# Altium project WroSat_RAD_SiPMT_detector_platform.PrjPCB (part 2 of 2)

## Sheet CAN_transceiver.SchDoc
size A4; Organization: Altium Limited; Address1: L3, 12a Rodborough Rd; Address2: Frenchs Forest; Address3: NSW; Address4: Australia 2086; DocumentNumber: 13; SheetNumber: 13; SheetTotal: 19
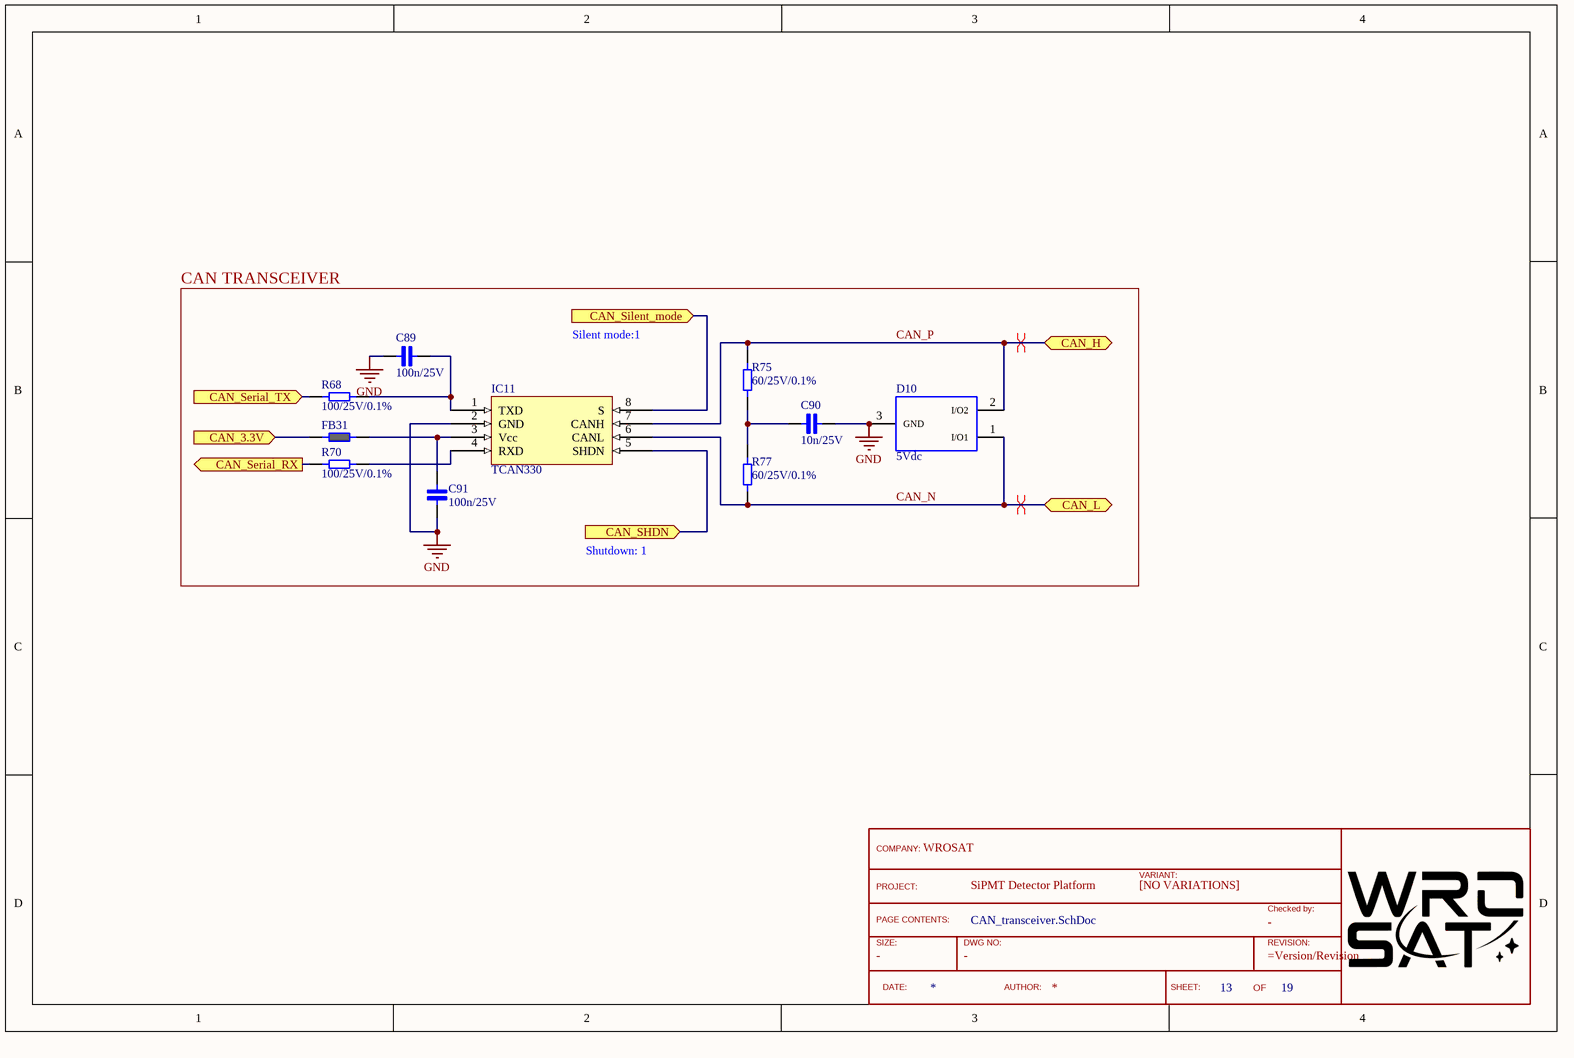
[diagram p8: CAN_transceiver.SchDoc]

### Parts
(Parts that share a designator on the sheet are numbered #1, #2 ... from top to bottom, then left to right.)
?#7  TitleBlock  (value not drawn)  (graphical)
C89  100n/25V  [Cap_0402]
C90  10n/25V  [Cap_0402]
C91  100n/25V  [Cap_0402]
D10  5Vdc  [WE-TVS_SOT23-3L]
FB31  Ferrite_bead_0402  [FERRITE_0402]  (value not drawn)
IC11  TCAN330  [SOIC8]
R68  100/25V/0.1%  [RES_0402]
R70  100/25V/0.1%  [RES_0402]
R75  60/25V/0.1%  [RES_1206]
R77  60/25V/0.1%  [RES_1206]

### Blocks framed on the sheet
CAN TRANSCEIVER: C89-C91 D10 FB31 IC11 R68 R70 R75 R77

### Ports
CAN_3.3V (in), CAN_H (bidir), CAN_L (bidir), CAN_Serial_RX (out), CAN_Serial_TX (in), CAN_SHDN (in), CAN_Silent_mode (in)

### Nets
GND: C89.1 C90.2 C91.1 D10.3(GND) IC11.2(GND)
CAN_3.3V: FB31.1 ; port CAN_3.3V
CAN_N: D10.1(I/O1) IC11.6(CANL) R77.1 ; port CAN_L
CAN_P: D10.2(I/O2) IC11.7(CANH) R75.2 ; port CAN_H
CAN_Serial_RX: R70.1 ; port CAN_Serial_RX
CAN_Serial_TX: R68.1 ; port CAN_Serial_TX
CAN_SHDN: IC11.5(SHDN) ; port CAN_SHDN
CAN_Silent_mode: IC11.8(S) ; port CAN_Silent_mode
NetC89_2: C89.2 IC11.1(TXD) R68.2
NetC90_1: C90.1 R75.1 R77.2
NetC91_2: C91.2 FB31.2 IC11.3(Vcc)
NetIC11_4: IC11.4(RXD) R70.2

### Layout directives
differential pair: CAN_N, CAN_P

### Notes on the sheet
- Silent mode:1
- Shutdown: 1
- Title
- Size:
- Date:
- A3
- Number:
- Time:
- Revision:
- Sheet
- of
- File:
- (in symbol TitleBlock) COMPANY:; VARIANT:; PROJECT:; [NO VARIATIONS]; Checked by:; PAGE CONTENTS:; SIZE:; DWG NO:; REVISION:; DATE:; AUTHOR:; SHEET:; OF

### Library data of the parts
?#7 = TitleBlock: Standard TitleBlock; DrawingNo: -; Size: -; Checked: -
C89 C91 = Cap_0402_100n: as C3 on sheet Preamplifier; ComponentLink1Description: New link; ComponentLink1URL: https://www.we-online.com/catalog/en/WCAP-CSGP-25VDC
C90 = Cap_0402_10n: as C32 on sheet General_design; ComponentLink1Description: New link; ComponentLink1URL: https://www.we-online.com/catalog/en/WCAP-CSGP-25VDC
D10 = 824022: WE-TVS TVS Diode - Standard Series, SOT23-3L, 2Channel, 5Vdc; Manufacturer: Wurth Elektronik; Reverse Breakdown Voltage min.: 6.1V; Channel: 2; Channel Input Capacitance: 12pF; Reverse Peak Pulse Current: 8A; Reverse Channel Leakage Current: 2.5uA; DC Operating Voltage: 5V; ComponentLink1Description: Manufacturer; ComponentLink1URL: http://www.we-online.de; ComponentLink2Description: Datasheet; ComponentLink2URL: https://www.we-online.com/catalog/datasheet/824022.pdf; Manufacturer Part Number: 824022; Published Date: April 2020; Size: SOT23-3L; Operating Temperature: -55 to +125degC; Mounting Technology: SMT; Packaging: Tape and Reel
FB31 = Ferrite_bead_0402: Ferrite bead, wurth 74269241102
IC11 = TCAN330: CAN transceiver, 3,3V
R68 R70 = Res_0402_100: Vishay, thin film resistor 100/25V/0.1%
R75 R77 = Res_1206_60: Vishay, thin film resistor 60/25V/0.1%

## Sheet MRAM.SchDoc
size A4; Organization: Altium Limited; Address1: L3, 12a Rodborough Rd; Address2: Frenchs Forest; Address3: NSW; Address4: Australia 2086; DocumentNumber: 15; SheetNumber: 15; SheetTotal: 19
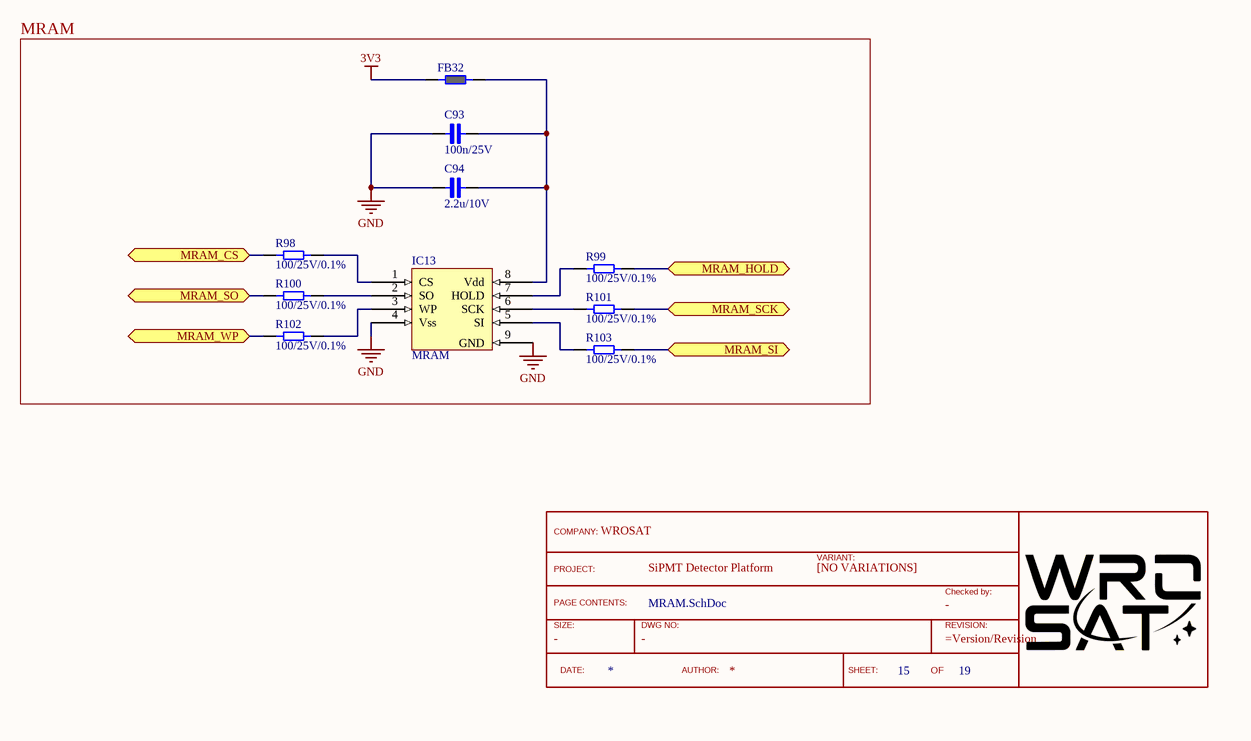
[diagram p9: MRAM.SchDoc]

### Parts
(Parts that share a designator on the sheet are numbered #1, #2 ... from top to bottom, then left to right.)
?#8  TitleBlock  (value not drawn)  (graphical)
C93  100n/25V  [Cap_0402]
C94  2.2u/10V  [CAP_0603]
FB32  Ferrite_bead_0402  [FERRITE_0402]  (value not drawn)
IC13  MRAM  [DFN8]
R98  100/25V/0.1%  [RES_0402]
R99  100/25V/0.1%  [RES_0402]
R100  100/25V/0.1%  [RES_0402]
R101  100/25V/0.1%  [RES_0402]
R102  100/25V/0.1%  [RES_0402]
R103  100/25V/0.1%  [RES_0402]

### Blocks framed on the sheet
MRAM: C93 C94 FB32 IC13 R98-R103

### Ports
MRAM_CS (bidir), MRAM_HOLD (bidir), MRAM_SCK (bidir), MRAM_SI (bidir), MRAM_SO (bidir), MRAM_WP (bidir)

### Nets
3V3: FB32.1
GND: C93.1 C94.1 IC13.4(Vss) IC13.9(GND)
MRAM_CS: R98.1 ; port MRAM_CS
MRAM_HOLD: R99.2 ; port MRAM_HOLD
MRAM_SCK: R101.2 ; port MRAM_SCK
MRAM_SI: R103.2 ; port MRAM_SI
MRAM_SO: R100.1 ; port MRAM_SO
MRAM_WP: R102.1 ; port MRAM_WP
NetC93_2: C93.2 C94.2 FB32.2 IC13.8(Vdd)
NetIC13_1: IC13.1(CS) R98.2
NetIC13_2: IC13.2(SO) R100.2
NetIC13_3: IC13.3(WP) R102.2
NetIC13_5: IC13.5(SI) R103.1
NetIC13_6: IC13.6(SCK) R101.1
NetIC13_7: IC13.7(HOLD) R99.1

### Notes on the sheet
- Title
- Size:
- Date:
- A3
- Number:
- Time:
- Revision:
- Sheet
- of
- File:
- (in symbol TitleBlock) COMPANY:; VARIANT:; PROJECT:; [NO VARIATIONS]; Checked by:; PAGE CONTENTS:; SIZE:; DWG NO:; REVISION:; DATE:; AUTHOR:; SHEET:; OF

### Library data of the parts
?#8 = TitleBlock: Standard TitleBlock; DrawingNo: -; Size: -; Checked: -
C93 = Cap_0402_100n: as C3 on sheet Preamplifier; ComponentLink1Description: New link; ComponentLink1URL: https://www.we-online.com/catalog/en/WCAP-CSGP-25VDC
C94 = Cap_0603_2.2u: Ceramic Capacitor 2.2uF / 0603 / 10V / ±5%, Wurth Elektronik MLCC
FB32 = Ferrite_bead_0402: Ferrite bead, wurth 74269241102
IC13 = MR25H128A: MRAM, 128Kb Serial SPI MRAM, EVERPIN technologies; ComponentLink1Description: New link; ComponentLink1URL: https://pl.mouser.com/datasheet/2/144/MR25H128A_Datasheet-1219034.pdf
R98-R103 = Res_0402_100: Vishay, thin film resistor 100/25V/0.1%

## Sheet LCL_pin_bias.SchDoc
size A4; Organization: Altium Limited; Address1: L3, 12a Rodborough Rd; Address2: Frenchs Forest; Address3: NSW; Address4: Australia 2086; DocumentNumber: 7; SheetNumber: 7; SheetTotal: 19
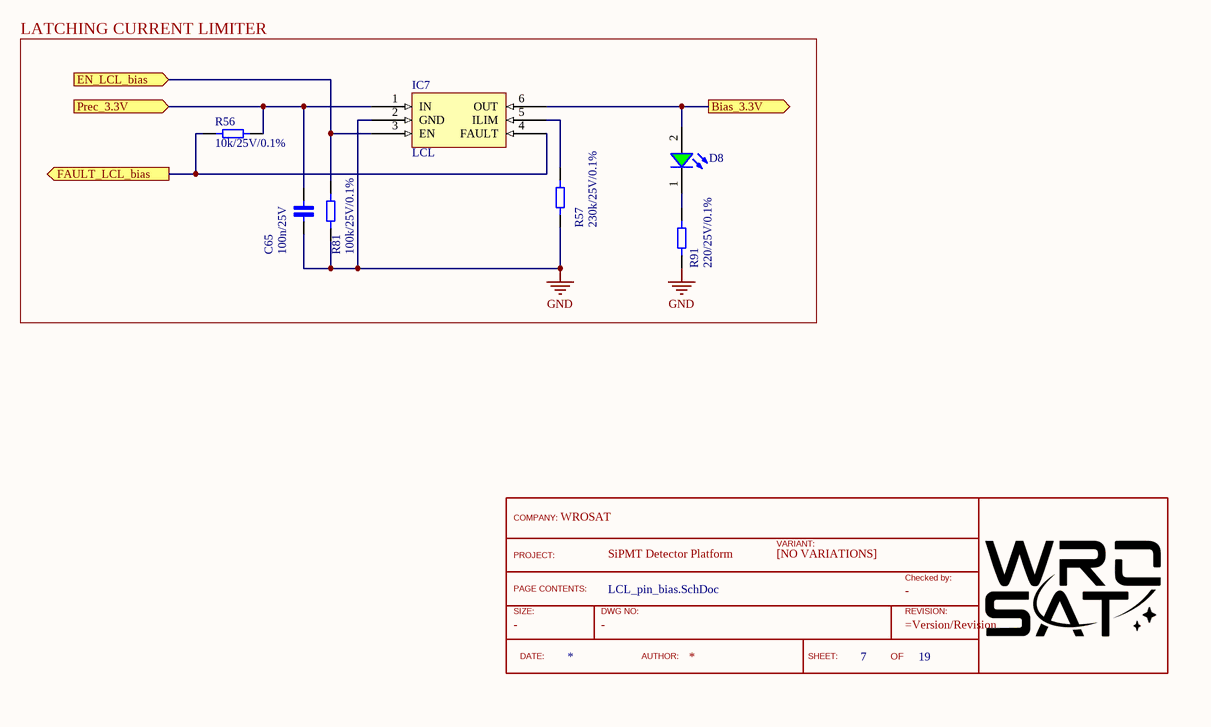
[diagram p10: LCL_pin_bias.SchDoc]

### Parts
(Parts that share a designator on the sheet are numbered #1, #2 ... from top to bottom, then left to right.)
?#9  TitleBlock  (value not drawn)  (graphical)
C65  100n/25V  [Cap_0402]
D8  Green, 3.2V  [WL-SMCW_0603_H=0.7mm]  (value not drawn)
IC7  LCL  [SOT-23-6]
R56  10k/25V/0.1%  [RES_0402]
R57  230k/25V/0.1%  [RES_0402]
R81  100k/25V/0.1%  [RES_0402]
R91  220/25V/0.1%  [RES_0402]

### Blocks framed on the sheet
LATCHING CURRENT LIMITER: C65 D8 IC7 R56 R57 R81 R91

### Ports
Bias_3.3V (out), EN_LCL_bias (in), FAULT_LCL_bias (out), Prec_3.3V (in)

### Nets
GND: C65.1 IC7.2(GND) R57.1 R81.1 R91.1
Bias_3.3V: D8.2(A) IC7.6(OUT) ; port Bias_3.3V
EN_LCL_bias: IC7.3(EN) R81.2 ; port EN_LCL_bias
FAULT_LCL_bias: IC7.4(FAULT) R56.1 ; port FAULT_LCL_bias
Prec_3.3V: C65.2 IC7.1(IN) R56.2 ; port Prec_3.3V
NetD8_1: D8.1(K) R91.2
NetIC7_5: IC7.5(ILIM) R57.2

### Notes on the sheet
- Title
- Size:
- Date:
- A3
- Number:
- Time:
- Revision:
- Sheet
- of
- File:
- (in symbol TitleBlock) COMPANY:; VARIANT:; PROJECT:; [NO VARIATIONS]; Checked by:; PAGE CONTENTS:; SIZE:; DWG NO:; REVISION:; DATE:; AUTHOR:; SHEET:; OF

### Library data of the parts
?#9 = TitleBlock: Standard TitleBlock; DrawingNo: -; Size: -; Checked: -
C65 = Cap_0402_100n: as C3 on sheet Preamplifier; ComponentLink1Description: New link; ComponentLink1URL: https://www.we-online.com/catalog/en/WCAP-CSGP-25VDC
D8 = 150060GS75000: as D3 on sheet General_design; Viewing Angle: 140deg; ComponentLink1Description: Manufacturer; ComponentLink1URL: http://www.we-online.de; ComponentLink2URL: https://www.we-online.com/catalog/datasheet/150060GS75000.pdf; ComponentLink2Description: Datasheet; Forward Voltage typ.: 3.2V; Emitting Color: Green; Mounting Technology: SMT; Operating Temperature: -40 to +85degC; Published Date: December 2019; Part Number: 150060GS75000; Packaging: Tape and Reel; Size: 0603; Publisher: Wurth Elektronik
IC7 = TPS2553: Latch-off Current Limiter; ComponentLink1Description: New link; ComponentLink1URL: https://www.ti.com/lit/ds/symlink/tps2553.pdf?ts=1603819295065&ref_url=https%253A%252F%252Fwww.google.com%252F
R56 = Res_0402_10k: Vishay, thin film resistor 10k/25V/0.1%
R57 = Res_0402_230k: Vishay, thin film resistor 230k/25V/0.1%
R81 = Res_0402_100k: Vishay, thin film resistor 100k/25V/0.1%
R91 = Res_0402_1: Vishay, thin film resistor 1/25V/0.1%

## Sheet prec_5V_LDO.SchDoc
size A4; Organization: Altium Limited; Address1: L3, 12a Rodborough Rd; Address2: Frenchs Forest; Address3: NSW; Address4: Australia 2086; DocumentNumber: 10; SheetNumber: 10; SheetTotal: 19
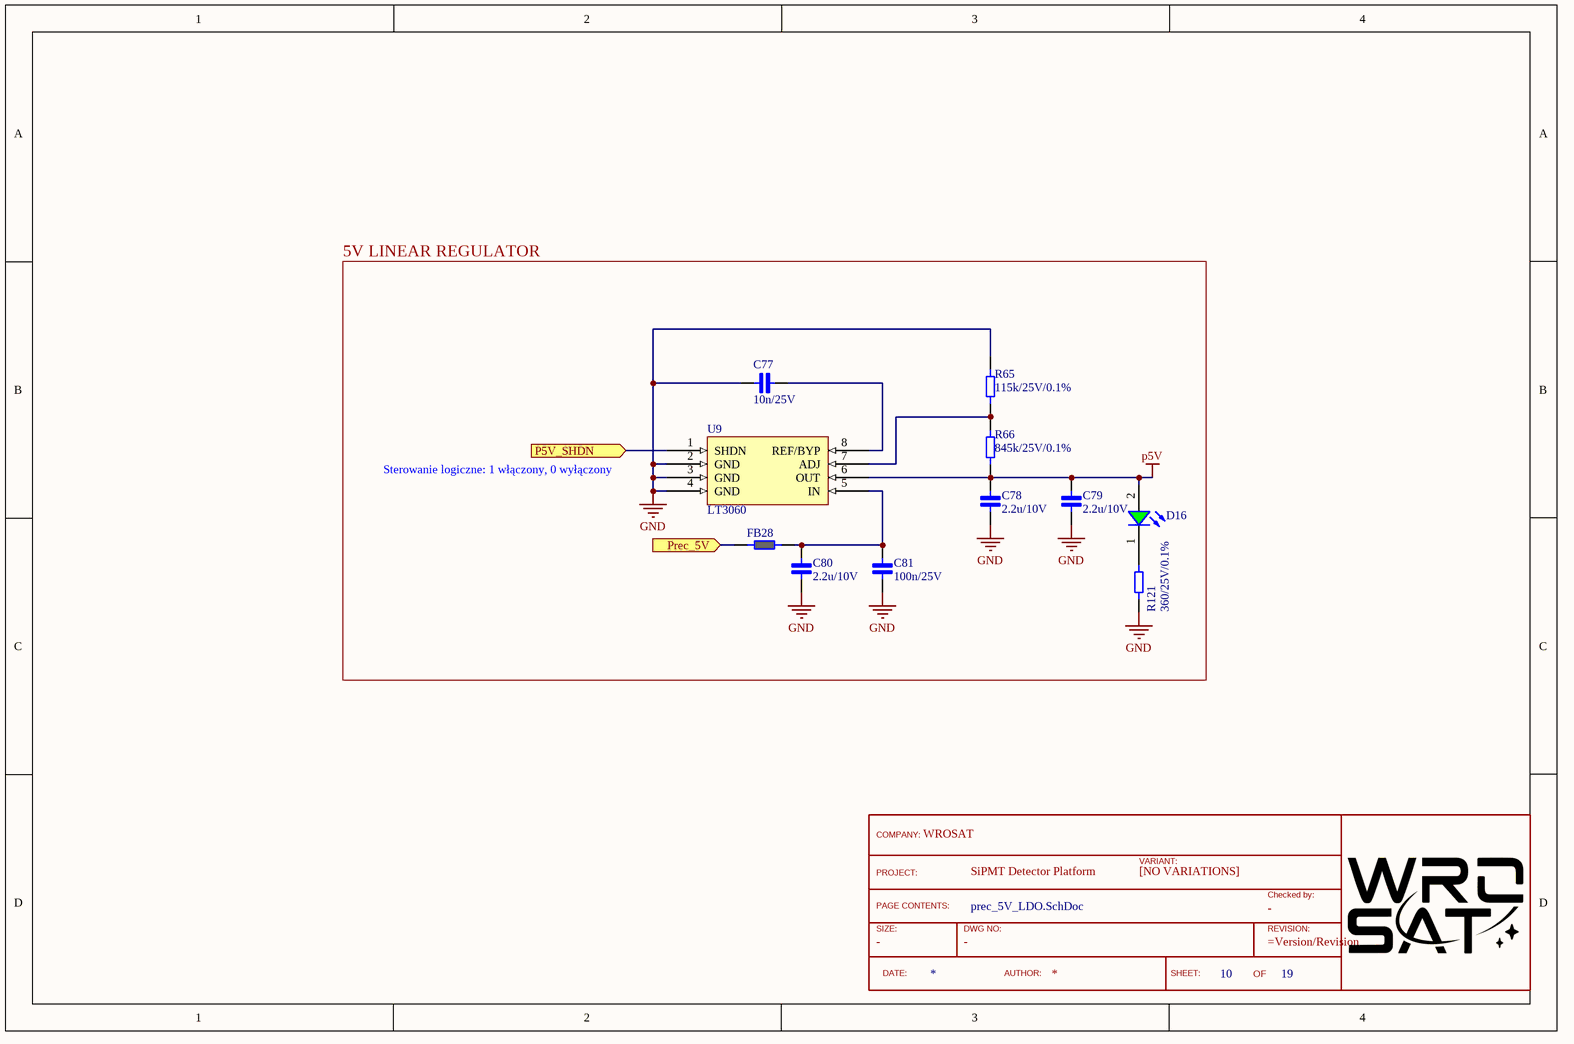
[diagram p11: prec_5V_LDO.SchDoc]

### Parts
(Parts that share a designator on the sheet are numbered #1, #2 ... from top to bottom, then left to right.)
?#10  TitleBlock  (value not drawn)  (graphical)
C77  10n/25V  [Cap_0402]
C78  2.2u/10V  [Cap_0402]
C79  2.2u/10V  [Cap_0402]
C80  2.2u/10V  [Cap_0402]
C81  100n/25V  [Cap_0402]
D16  Green, 3.2V  [WL-SMCW_0603_H=0.7mm]  (value not drawn)
FB28  Ferrite_bead_0402  [FERRITE_0402]  (value not drawn)
R65  115k/25V/0.1%  [RES_0402]
R66  845k/25V/0.1%  [RES_0402]
R121  360/25V/0.1%  [RES_0402]
U9  LT3060  [TS8]

### Blocks framed on the sheet
5V LINEAR REGULATOR: C77-C81 D16 FB28 R65 R66 R121 U9

### Ports
P5V_SHDN (in), Prec_5V (in)

### Nets
GND: C77.2 C78.1 C79.1 C80.1 C81.1 R65.2 R121.1 U9.2(GND) U9.3(GND) U9.4(GND)
p5V: C78.2 C79.2 D16.2(A) R66.1 U9.6(OUT)
P5V_SHDN: U9.1(SHDN) ; port P5V_SHDN
Prec_5V: FB28.1 ; port Prec_5V
NetC77_1: C77.1 U9.8(REF/BYP)
NetC80_2: C80.2 C81.2 FB28.2 U9.5(IN)
NetD16_1: D16.1(K) R121.2
NetR65_1: R65.1 R66.2 U9.7(ADJ)

### Notes on the sheet
- Sterowanie logiczne: 1 włączony, 0 wyłączony
- Title
- Size:
- Date:
- A3
- Number:
- Time:
- Revision:
- Sheet
- of
- File:
- (in symbol TitleBlock) COMPANY:; VARIANT:; PROJECT:; [NO VARIATIONS]; Checked by:; PAGE CONTENTS:; SIZE:; DWG NO:; REVISION:; DATE:; AUTHOR:; SHEET:; OF

### Library data of the parts
?#10 = TitleBlock: Standard TitleBlock; DrawingNo: -; Size: -; Checked: -
C77 = Cap_0402_10n: as C32 on sheet General_design; ComponentLink1Description: New link; ComponentLink1URL: https://www.we-online.com/catalog/en/WCAP-CSGP-25VDC
C78-C80 = Cap_0402_2.2u: as C2 on sheet Preamplifier
C81 = Cap_0402_100n: as C3 on sheet Preamplifier; ComponentLink1Description: New link; ComponentLink1URL: https://www.we-online.com/catalog/en/WCAP-CSGP-25VDC
D16 = 150060GS75000: as D3 on sheet General_design; Viewing Angle: 140deg; ComponentLink1Description: Manufacturer; ComponentLink1URL: http://www.we-online.de; ComponentLink2URL: https://www.we-online.com/catalog/datasheet/150060GS75000.pdf; ComponentLink2Description: Datasheet; Forward Voltage typ.: 3.2V; Emitting Color: Green; Mounting Technology: SMT; Operating Temperature: -40 to +85degC; Published Date: December 2019; Part Number: 150060GS75000; Packaging: Tape and Reel; Size: 0603; Publisher: Wurth Elektronik
FB28 = Ferrite_bead_0402: Ferrite bead, wurth 74269241102
R65 = Res_0402_115k: Vishay, thin film resistor 115k/25V/0.1%
R66 = Res_0402_845k: Vishay, thin film resistor 845k/25V/0.1%
R121 = Res_0402_1: Vishay, thin film resistor 1/25V/0.1%
U9 = Lt3060: as U7 on sheet prec_3V_LDO

## Sheet LCL_12V_prec.SchDoc
size A4; Organization: Altium Limited; Address1: L3, 12a Rodborough Rd; Address2: Frenchs Forest; Address3: NSW; Address4: Australia 2086; DocumentNumber: 11; SheetNumber: 11; SheetTotal: 19
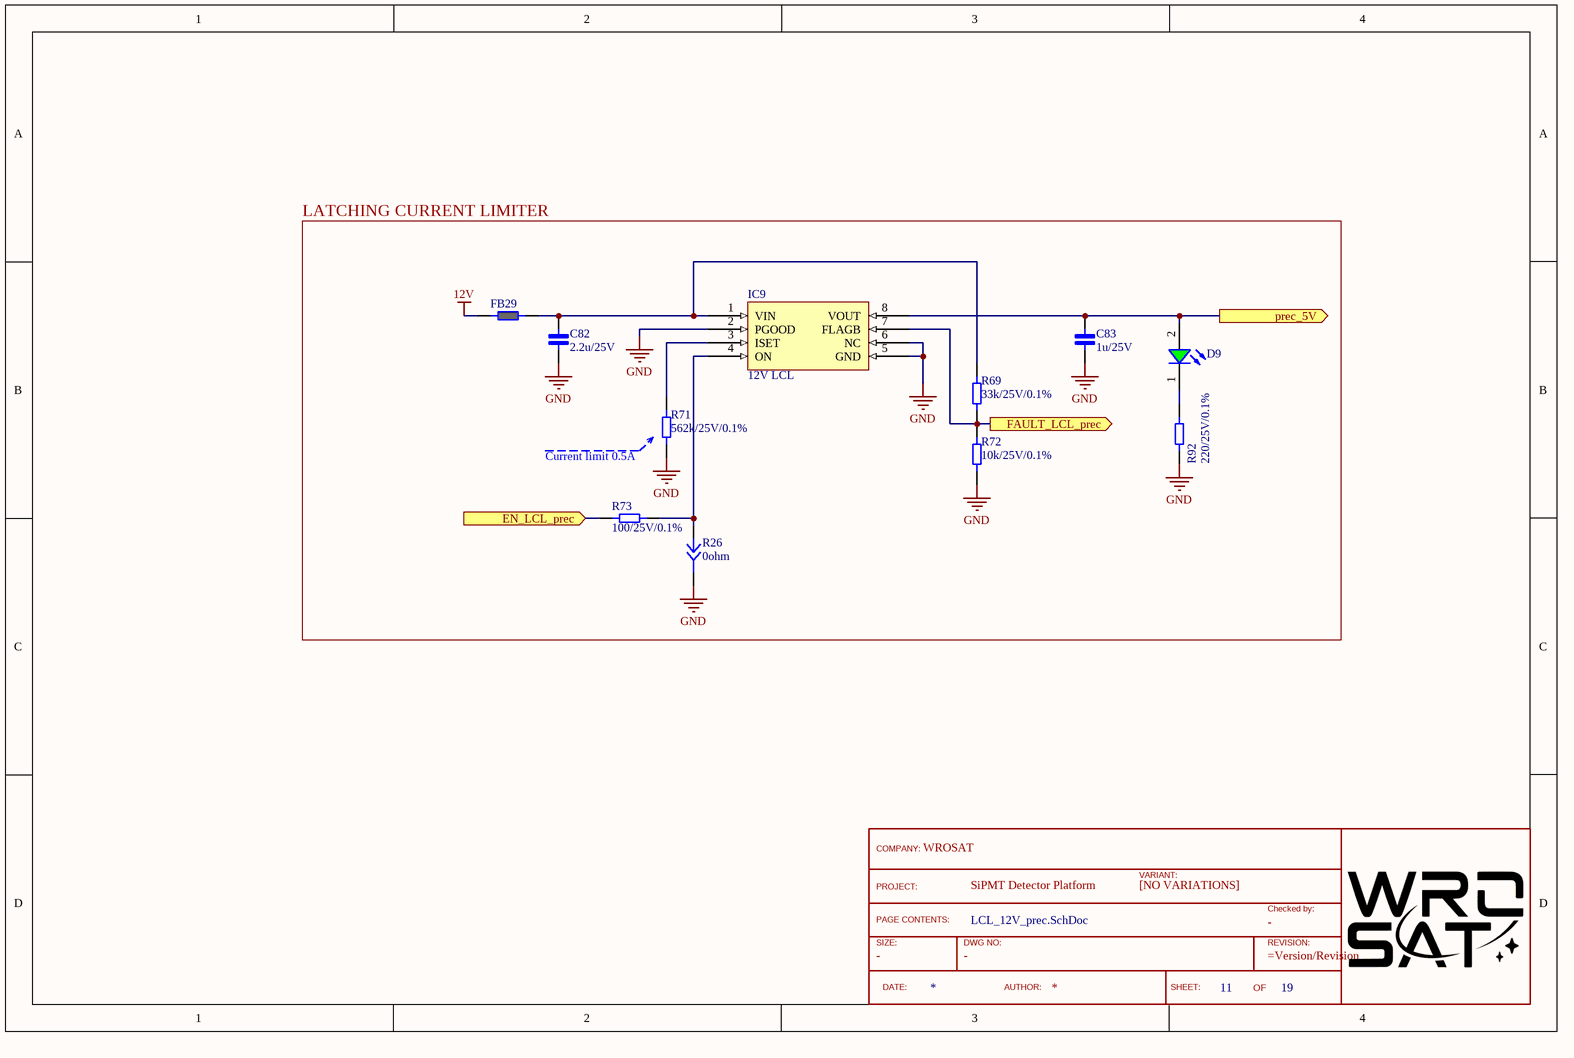
[diagram p12: LCL_12V_prec.SchDoc]

### Parts
(Parts that share a designator on the sheet are numbered #1, #2 ... from top to bottom, then left to right.)
?#11  TitleBlock  (value not drawn)  (graphical)
C82  2.2u/25V  [CAP_0603]
C83  1u/25V  [CAP_0603]
D9  Green, 3.2V  [WL-SMCW_0603_H=0.7mm]  (value not drawn)
FB29  Ferrite_bead_0603  [Ferrite_0603]  (value not drawn)
IC9  12V LCL  [SO8]
R26  0ohm  [Jumper 2]
R69  33k/25V/0.1%  [RES_0402]
R71  562k/25V/0.1%  [RES_0402]
R72  10k/25V/0.1%  [RES_0402]
R73  100/25V/0.1%  [RES_0402]
R92  220/25V/0.1%  [RES_0402]

### Blocks framed on the sheet
LATCHING CURRENT LIMITER: C82 C83 D9 FB29 IC9 R26 R69 R71-R73 R92

### Ports
EN_LCL_prec (in), FAULT_LCL_prec (out), prec_5V (out)

### Nets
12V: FB29.1
GND: C82.1 C83.1 IC9.2(PGOOD) IC9.5(GND) IC9.6(NC) R26.2 R71.1 R72.1 R92.1
EN_LCL_prec: R73.1 ; port EN_LCL_prec
FAULT_LCL_prec: IC9.7(FLAGB) R69.1 R72.2 ; port FAULT_LCL_prec
Prec_5V: C83.2 D9.2(A) IC9.8(VOUT) ; port prec_5V
NetC82_2: C82.2 FB29.2 IC9.1(VIN) R69.2
NetD9_1: D9.1(K) R92.2
NetIC9_3: IC9.3(ISET) R71.2
NetIC9_4: IC9.4(ON) R26.1 R73.2

### Notes on the sheet
- (near R71) Current limit 0.5A
- Title
- Size:
- Date:
- A3
- Number:
- Time:
- Revision:
- Sheet
- of
- File:
- (in symbol TitleBlock) COMPANY:; VARIANT:; PROJECT:; [NO VARIATIONS]; Checked by:; PAGE CONTENTS:; SIZE:; DWG NO:; REVISION:; DATE:; AUTHOR:; SHEET:; OF

### Library data of the parts
?#11 = TitleBlock: Standard TitleBlock; DrawingNo: -; Size: -; Checked: -
C82 = Cap_0603_2.2u_25v: Ceramic Capacitor 2.2uF / 0603 / 25V / ±5%, Wurth Elektronik MLCC
C83 = Cap_0603_1u_25v: Ceramic Capacitor 1uF / 0603 / 25V / ±5%, Wurth Elektronik MLCC
D9 = 150060GS75000: as D3 on sheet General_design; Viewing Angle: 140deg; ComponentLink1Description: Manufacturer; ComponentLink1URL: http://www.we-online.de; ComponentLink2URL: https://www.we-online.com/catalog/datasheet/150060GS75000.pdf; ComponentLink2Description: Datasheet; Forward Voltage typ.: 3.2V; Emitting Color: Green; Mounting Technology: SMT; Operating Temperature: -40 to +85degC; Published Date: December 2019; Part Number: 150060GS75000; Packaging: Tape and Reel; Size: 0603; Publisher: Wurth Elektronik
FB29 = Ferrite_bead_0603: Ferrite bead
IC9 = FPF2700: FPF270xMX
R26 = Mini jumper
R69 = Res_0402_33k: Vishay, thin film resistor 33k/25V/0.1%
R71 = Res_0402_562k: Vishay, thin film resistor 562k/25V/0.1%
R72 = Res_0402_10k: Vishay, thin film resistor 10k/25V/0.1%
R73 = Res_0402_100: Vishay, thin film resistor 100/25V/0.1%
R92 = Res_0402_1: Vishay, thin film resistor 1/25V/0.1%

## Sheet LCL_12V_chp.SchDoc
size A4; Organization: Altium Limited; Address1: L3, 12a Rodborough Rd; Address2: Frenchs Forest; Address3: NSW; Address4: Australia 2086; DocumentNumber: 12; SheetNumber: 12; SheetTotal: 19
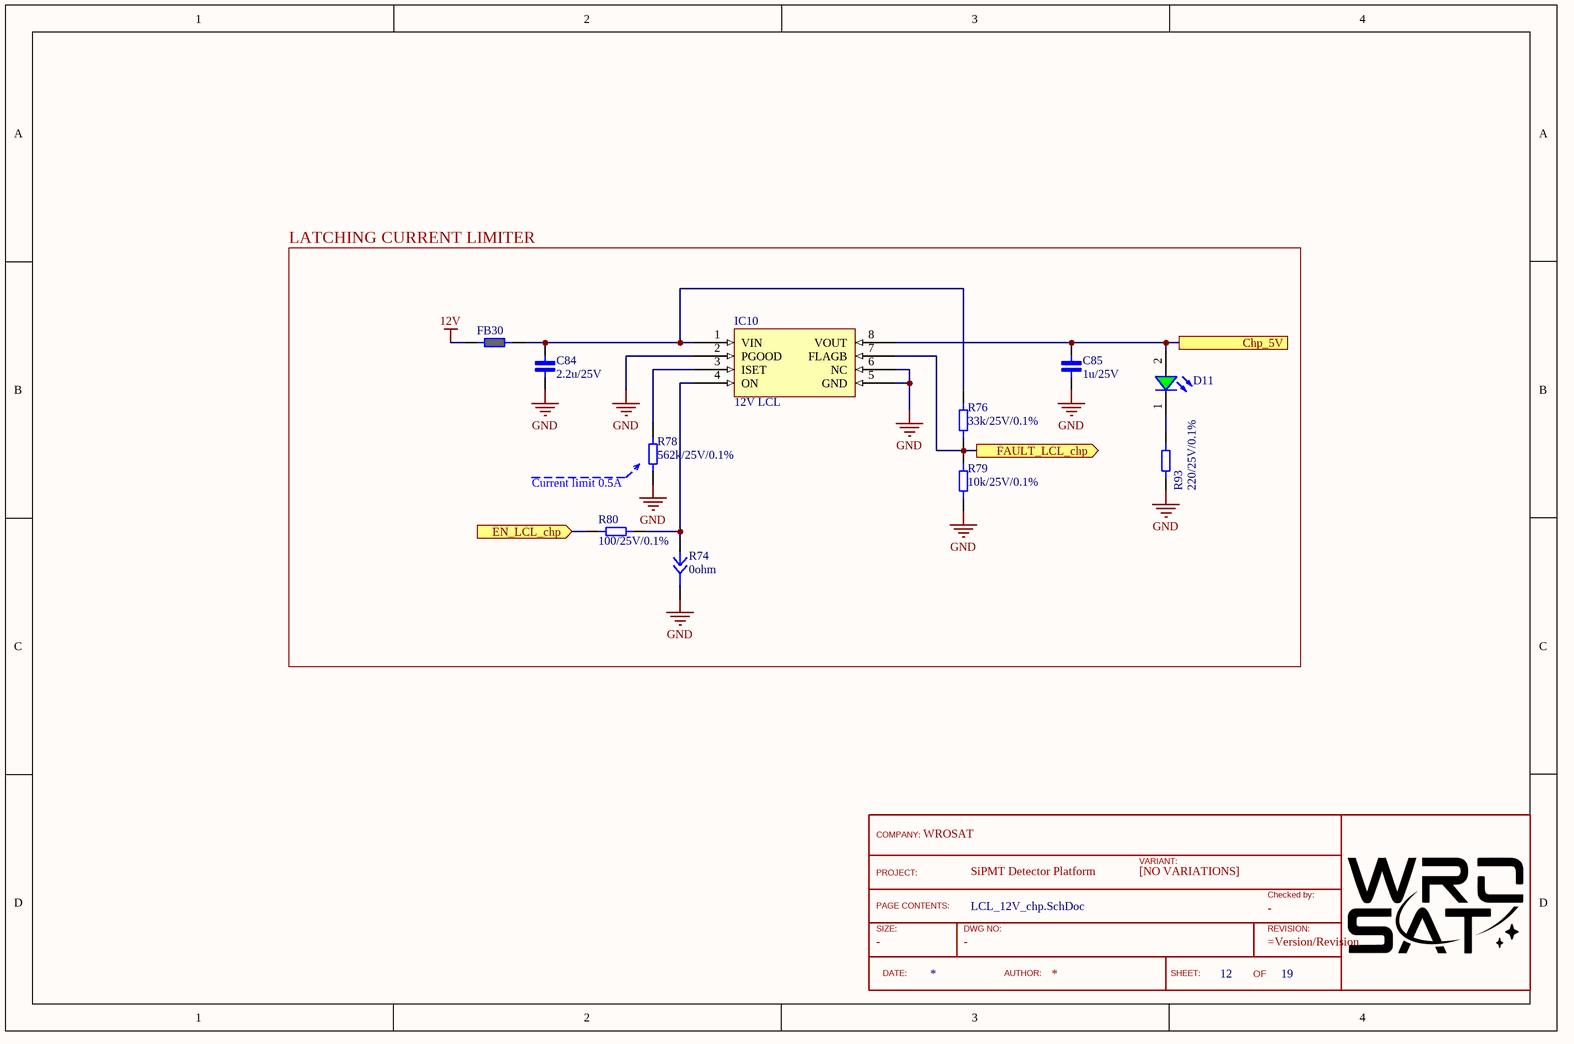
[diagram p13: LCL_12V_chp.SchDoc]

### Parts
(Parts that share a designator on the sheet are numbered #1, #2 ... from top to bottom, then left to right.)
?#12  TitleBlock  (value not drawn)  (graphical)
C84  2.2u/25V  [CAP_0603]
C85  1u/25V  [CAP_0603]
D11  Green, 3.2V  [WL-SMCW_0603_H=0.7mm]  (value not drawn)
FB30  Ferrite_bead_0603  [Ferrite_0603]  (value not drawn)
IC10  12V LCL  [SO8]
R74  0ohm  [Jumper 2]
R76  33k/25V/0.1%  [RES_0402]
R78  562k/25V/0.1%  [RES_0402]
R79  10k/25V/0.1%  [RES_0402]
R80  100/25V/0.1%  [RES_0402]
R93  220/25V/0.1%  [RES_0402]

### Blocks framed on the sheet
LATCHING CURRENT LIMITER: C84 C85 D11 FB30 IC10 R74 R76 R78-R80 R93

### Ports
Chp_5V, EN_LCL_chp (in), FAULT_LCL_chp (out)

### Nets
12V: FB30.1
GND: C84.1 C85.1 IC10.2(PGOOD) IC10.5(GND) IC10.6(NC) R74.2 R78.1 R79.1 R93.1
Chp_5V: C85.2 D11.2(A) IC10.8(VOUT) ; port Chp_5V
EN_LCL_chp: R80.2 ; port EN_LCL_chp
FAULT_LCL_chp: IC10.7(FLAGB) R76.1 R79.2 ; port FAULT_LCL_chp
NetC84_2: C84.2 FB30.2 IC10.1(VIN) R76.2
NetD11_1: D11.1(K) R93.2
NetIC10_3: IC10.3(ISET) R78.2
NetIC10_4: IC10.4(ON) R74.1 R80.1

### Notes on the sheet
- (near R78) Current limit 0.5A
- Title
- Size:
- Date:
- A3
- Number:
- Time:
- Revision:
- Sheet
- of
- File:
- (in symbol TitleBlock) COMPANY:; VARIANT:; PROJECT:; [NO VARIATIONS]; Checked by:; PAGE CONTENTS:; SIZE:; DWG NO:; REVISION:; DATE:; AUTHOR:; SHEET:; OF

### Library data of the parts
?#12 = TitleBlock: Standard TitleBlock; DrawingNo: -; Size: -; Checked: -
C84 = Cap_0603_2.2u_25v: as C82 on sheet LCL_12V_prec
C85 = Cap_0603_1u_25v: as C83 on sheet LCL_12V_prec
D11 = 150060GS75000: as D3 on sheet General_design; Viewing Angle: 140deg; ComponentLink1Description: Manufacturer; ComponentLink1URL: http://www.we-online.de; ComponentLink2URL: https://www.we-online.com/catalog/datasheet/150060GS75000.pdf; ComponentLink2Description: Datasheet; Forward Voltage typ.: 3.2V; Emitting Color: Green; Mounting Technology: SMT; Operating Temperature: -40 to +85degC; Published Date: December 2019; Part Number: 150060GS75000; Packaging: Tape and Reel; Size: 0603; Publisher: Wurth Elektronik
FB30 = Ferrite_bead_0603: Ferrite bead
IC10 = FPF2700: FPF270xMX
R74 = Mini jumper
R76 = Res_0402_33k: Vishay, thin film resistor 33k/25V/0.1%
R78 = Res_0402_562k: Vishay, thin film resistor 562k/25V/0.1%
R79 = Res_0402_10k: Vishay, thin film resistor 10k/25V/0.1%
R80 = Res_0402_100: Vishay, thin film resistor 100/25V/0.1%
R93 = Res_0402_1: Vishay, thin film resistor 1/25V/0.1%

## Sheet Dual_signal_switch.SchDoc
size A4; Organization: Altium Limited; Address1: L3, 12a Rodborough Rd; Address2: Frenchs Forest; Address3: NSW; Address4: Australia 2086; DocumentNumber: 18; SheetNumber: 18; SheetTotal: 19
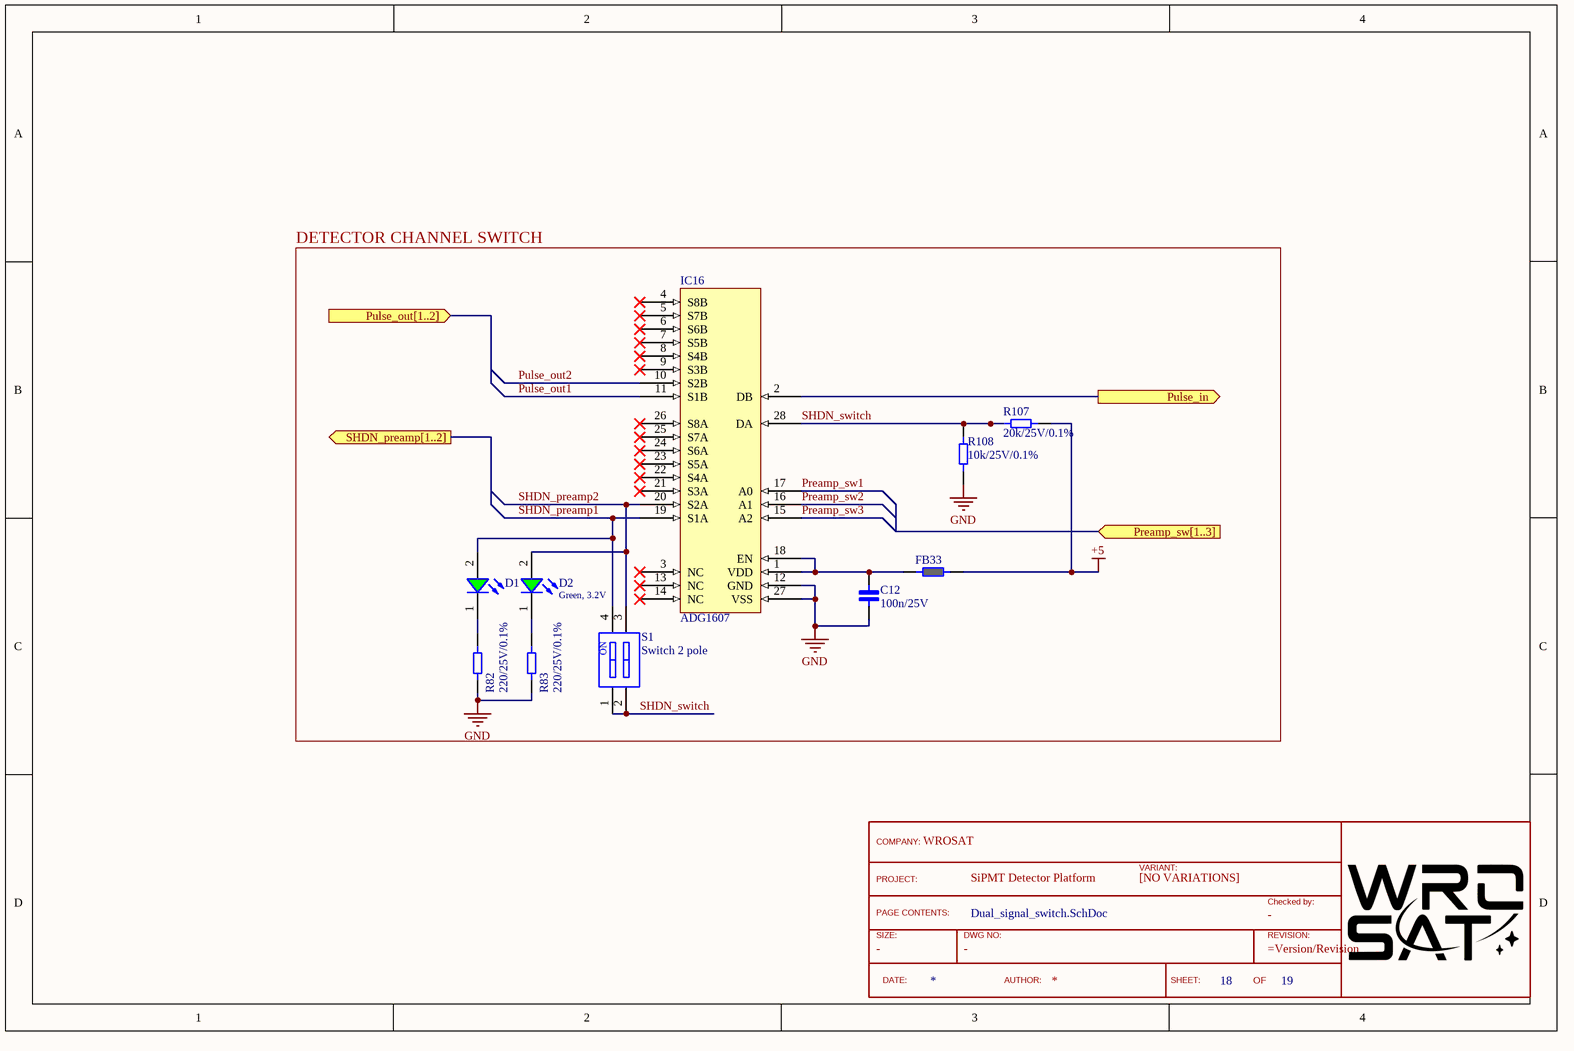
[diagram p14: Dual_signal_switch.SchDoc]

### Parts
(Parts that share a designator on the sheet are numbered #1, #2 ... from top to bottom, then left to right.)
?#13  TitleBlock  (value not drawn)  (graphical)
C12  100n/25V  [Cap_0402]
D1  Green, 3.2V  [WL-SMCW_0603_H=0.7mm]  (value not drawn)
D2  Green, 3.2V  [WL-SMCW_0603_H=0.7mm]
FB33  Ferrite_bead_0402  [FERRITE_0402]  (value not drawn)
IC16  ADG1607  [TSOP28]
R82  220/25V/0.1%  [RES_0402]
R83  220/25V/0.1%  [RES_0402]
R107  20k/25V/0.1%  [RES_0402]
R108  10k/25V/0.1%  [RES_0402]
S1  Switch 2 pole  [Dip Switch 2]

### Blocks framed on the sheet
DETECTOR CHANNEL SWITCH: C12 D1 D2 FB33 IC16 R82 R83 R107 R108 S1

### Ports
Preamp_sw[1..3] (in), Pulse_in (out), Pulse_out[1..2] (in), SHDN_preamp[1..2] (out)

### Nets
+5: FB33.2 R107.2
GND: C12.1 IC16.12(GND) IC16.27(VSS) R82.1 R83.1 R108.1
Preamp_sw1: IC16.17(A0)
Preamp_sw2: IC16.16(A1)
Preamp_sw3: IC16.15(A2)
Pulse_in: IC16.2(DB) ; port Pulse_in
Pulse_out1: IC16.11(S1B)
Pulse_out2: IC16.10(S2B)
SHDN_preamp1: D1.2(A) IC16.19(S1A) S1.4
SHDN_preamp2: D2.2(A) IC16.20(S2A) S1.3
SHDN_switch: IC16.28(DA) R107.1 R108.2 S1.1 S1.2
NetC12_2: C12.2 FB33.1 IC16.1(VDD) IC16.18(EN)
NetD1_1: D1.1(K) R82.2
NetD2_1: D2.1(K) R83.2

Not connected (* = marked no-connect by the designer): IC16 3(NC)* 4(S8B)* 5(S7B)* 6(S6B)* 7(S5B)* 8(S4B)* 9(S3B)* 13(NC)* 14(NC)* 21(S3A)* 22(S4A)* 23(S5A)* 24(S6A)* 25(S7A)* 26(S8A)*

### Notes on the sheet
- Title
- Size:
- Date:
- A3
- Number:
- Time:
- Revision:
- Sheet
- of
- File:
- (in symbol Switch 2 pole) ON
- (in symbol TitleBlock) COMPANY:; VARIANT:; PROJECT:; [NO VARIATIONS]; PAGE CONTENTS:; Checked by:; SIZE:; DWG NO:; REVISION:; DATE:; AUTHOR:; SHEET:; OF

### Library data of the parts
?#13 = TitleBlock: Standard TitleBlock; DrawingNo: -; Size: -; Checked: -
C12 = Cap_0402_100n: Ceramic Capacitor 100n / 0402 / 25V / ±5%, Wurth Elektronik MLCC; ComponentLink1Description: New link; ComponentLink1URL: https://www.we-online.com/catalog/en/WCAP-CSGP-25VDC
D1 D2 = 150060GS75000: WL-SMCW SMT Mono-color Chip LED Waterclear, size 0603, Green, 3.2V, 140deg; Chip Technology: InGaN; Dominant Wavelength typ.: 525nm; Luminous Intensity typ.: 430mcd; Peak Wavelength typ.: 515nm; Viewing Angle: 140deg; ComponentLink1Description: Manufacturer; ComponentLink1URL: http://www.we-online.de; ComponentLink2URL: https://www.we-online.com/catalog/datasheet/150060GS75000.pdf; ComponentLink2Description: Datasheet; Forward Voltage typ.: 3.2V; Emitting Color: Green; Mounting Technology: SMT; Operating Temperature: -40 to +85degC; Published Date: December 2019; Part Number: 150060GS75000; Packaging: Tape and Reel; Size: 0603; Publisher: Wurth Elektronik
FB33 = Ferrite_bead_0402: Ferrite bead, wurth 74269241102
IC16 = ADG1607: 8-ch MUX; ComponentLink1Description: New link; ComponentLink1URL: https://pl.mouser.com/datasheet/2/609/ADG1606_1607-1502923.pdf
R82 R83 = Res_0402_1: Vishay, thin film resistor 1/25V/0.1%
R107 = Res_0402_20k: Vishay, thin film resistor 20k/25V/0.1%
R108 = Res_0402_10k: Vishay, thin film resistor 10k/25V/0.1%
S1 = Switch 2 pole: WS-DISV Small Compact SMD Dip Switch, Flat Actuator with Top Tape, pitch 1.27mm, 2p; Part Number: 416131160802; Operation Force: 500g; Pole Number: 2; Actuator Type: Flat Type; Circuit: SPST-NO; Rated Current Switching: 25mA; Rated Current Non-Switching: 100mA; Rated Voltage Non-Switching: 50VDC; Rated Voltage Switching: 24VDC; ComponentLink1Description: Manufacturer; ComponentLink1URL: http://www.we-online.de; ComponentLink2Description: Datasheet; ComponentLink2URL: https://katalog.we-online.com/em/datasheet/416131160802.pdf; Pitch: 1.27mm; Contact Material: Copper Alloy; Mounting Technology: SMT; Operating Temperature: -40 to +85degC; Contact Plating: Gold; Packaging: Tape and Reel; Publisher: Wurth Elektronik; Published Date: September 2019

## Sheet MCU_LDO.SchDoc
size A4; Organization: Altium Limited; Address1: L3, 12a Rodborough Rd; Address2: Frenchs Forest; Address3: NSW; Address4: Australia 2086; DocumentNumber: 9; SheetNumber: 9; SheetTotal: 19
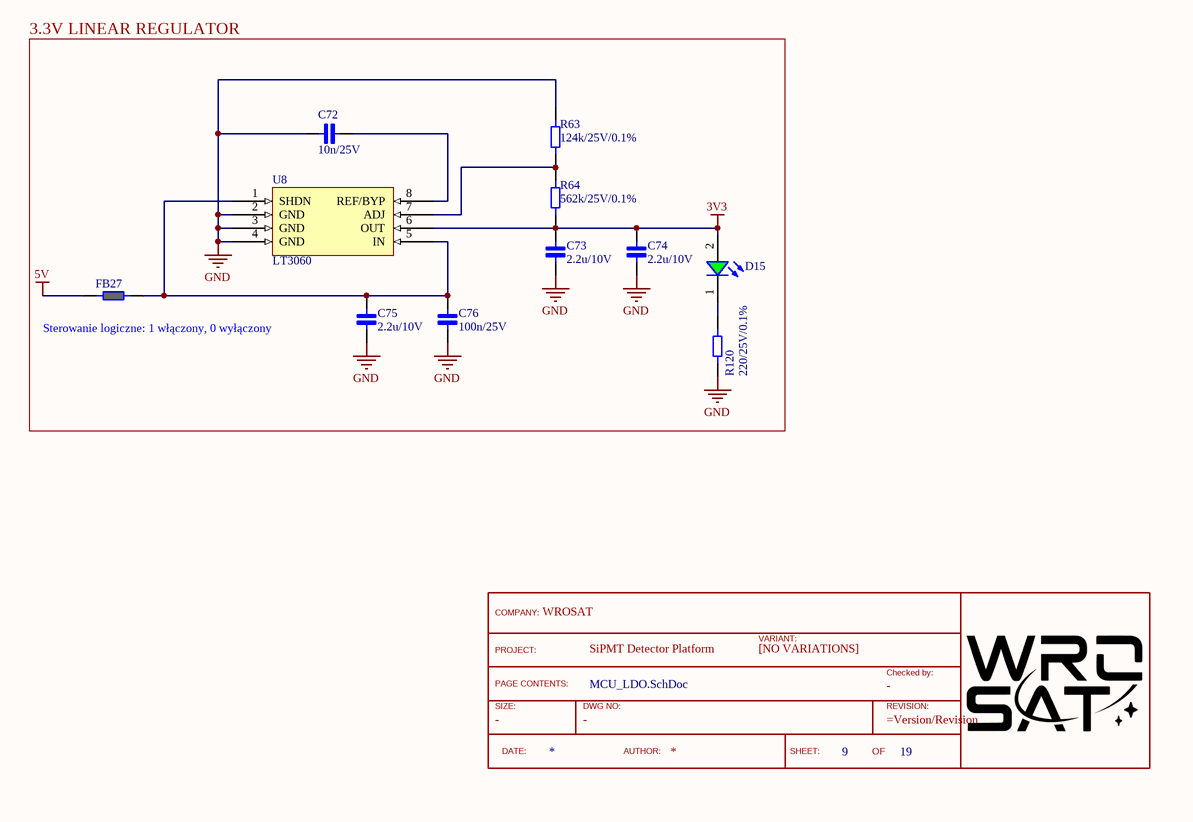
[diagram p15: MCU_LDO.SchDoc]

### Parts
(Parts that share a designator on the sheet are numbered #1, #2 ... from top to bottom, then left to right.)
?#14  TitleBlock  (value not drawn)  (graphical)
C72  10n/25V  [Cap_0402]
C73  2.2u/10V  [Cap_0402]
C74  2.2u/10V  [Cap_0402]
C75  2.2u/10V  [Cap_0402]
C76  100n/25V  [Cap_0402]
D15  Green, 3.2V  [WL-SMCW_0603_H=0.7mm]  (value not drawn)
FB27  Ferrite_bead_0402  [FERRITE_0402]  (value not drawn)
R63  124k/25V/0.1%  [RES_0402]
R64  562k/25V/0.1%  [RES_0402]
R120  220/25V/0.1%  [RES_0402]
U8  LT3060  [TS8]

### Blocks framed on the sheet
3.3V LINEAR REGULATOR: C72-C76 D15 FB27 R63 R64 R120 U8

### Nets
3V3: C73.2 C74.2 D15.2(A) R64.1 U8.6(OUT)
5V: FB27.1
GND: C72.1 C73.1 C74.1 C75.1 C76.1 R63.2 R120.1 U8.2(GND) U8.3(GND) U8.4(GND)
NetC72_2: C72.2 U8.8(REF/BYP)
NetC75_2: C75.2 C76.2 FB27.2 U8.1(SHDN) U8.5(IN)
NetD15_1: D15.1(K) R120.2
NetR63_1: R63.1 R64.2 U8.7(ADJ)

### Notes on the sheet
- (near FB27) Sterowanie logiczne: 1 włączony, 0 wyłączony
- Title
- Size:
- Date:
- A3
- Number:
- Time:
- Revision:
- Sheet
- of
- File:
- (in symbol TitleBlock) COMPANY:; VARIANT:; PROJECT:; [NO VARIATIONS]; Checked by:; PAGE CONTENTS:; SIZE:; DWG NO:; REVISION:; DATE:; AUTHOR:; SHEET:; OF

### Library data of the parts
?#14 = TitleBlock: Standard TitleBlock; DrawingNo: -; Size: -; Checked: -
C72 = Cap_0402_10n: Ceramic Capacitor 10n / 0402 / 25V / ±5%, Wurth Elektronik MLCC; ComponentLink1Description: New link; ComponentLink1URL: https://www.we-online.com/catalog/en/WCAP-CSGP-25VDC
C73-C75 = Cap_0402_2.2u: Ceramic Capacitor 2.2uF / 0402 / 10V / ±5%, Wurth Elektronik MLCC
C76 = Cap_0402_100n: as C12 on sheet Dual_signal_switch; ComponentLink1Description: New link; ComponentLink1URL: https://www.we-online.com/catalog/en/WCAP-CSGP-25VDC
D15 = 150060GS75000: as D1 on sheet Dual_signal_switch; Viewing Angle: 140deg; ComponentLink1Description: Manufacturer; ComponentLink1URL: http://www.we-online.de; ComponentLink2URL: https://www.we-online.com/catalog/datasheet/150060GS75000.pdf; ComponentLink2Description: Datasheet; Forward Voltage typ.: 3.2V; Emitting Color: Green; Mounting Technology: SMT; Operating Temperature: -40 to +85degC; Published Date: December 2019; Part Number: 150060GS75000; Packaging: Tape and Reel; Size: 0603; Publisher: Wurth Elektronik
FB27 = Ferrite_bead_0402: Ferrite bead, wurth 74269241102
R63 = Res_0402_124k: Vishay, thin film resistor 124k/25V/0.1%
R64 = Res_0402_562k: Vishay, thin film resistor 562k/25V/0.1%
R120 = Res_0402_1: Vishay, thin film resistor 1/25V/0.1%
U8 = Lt3060: 45V VIN, Micropower, / Low Noise, 100mA Low / Dropout, Linear Regulator

## Sheet LCL_CAN.SchDoc
size A4; Organization: Altium Limited; Address1: L3, 12a Rodborough Rd; Address2: Frenchs Forest; Address3: NSW; Address4: Australia 2086; DocumentNumber: 14; SheetNumber: 14; SheetTotal: 19
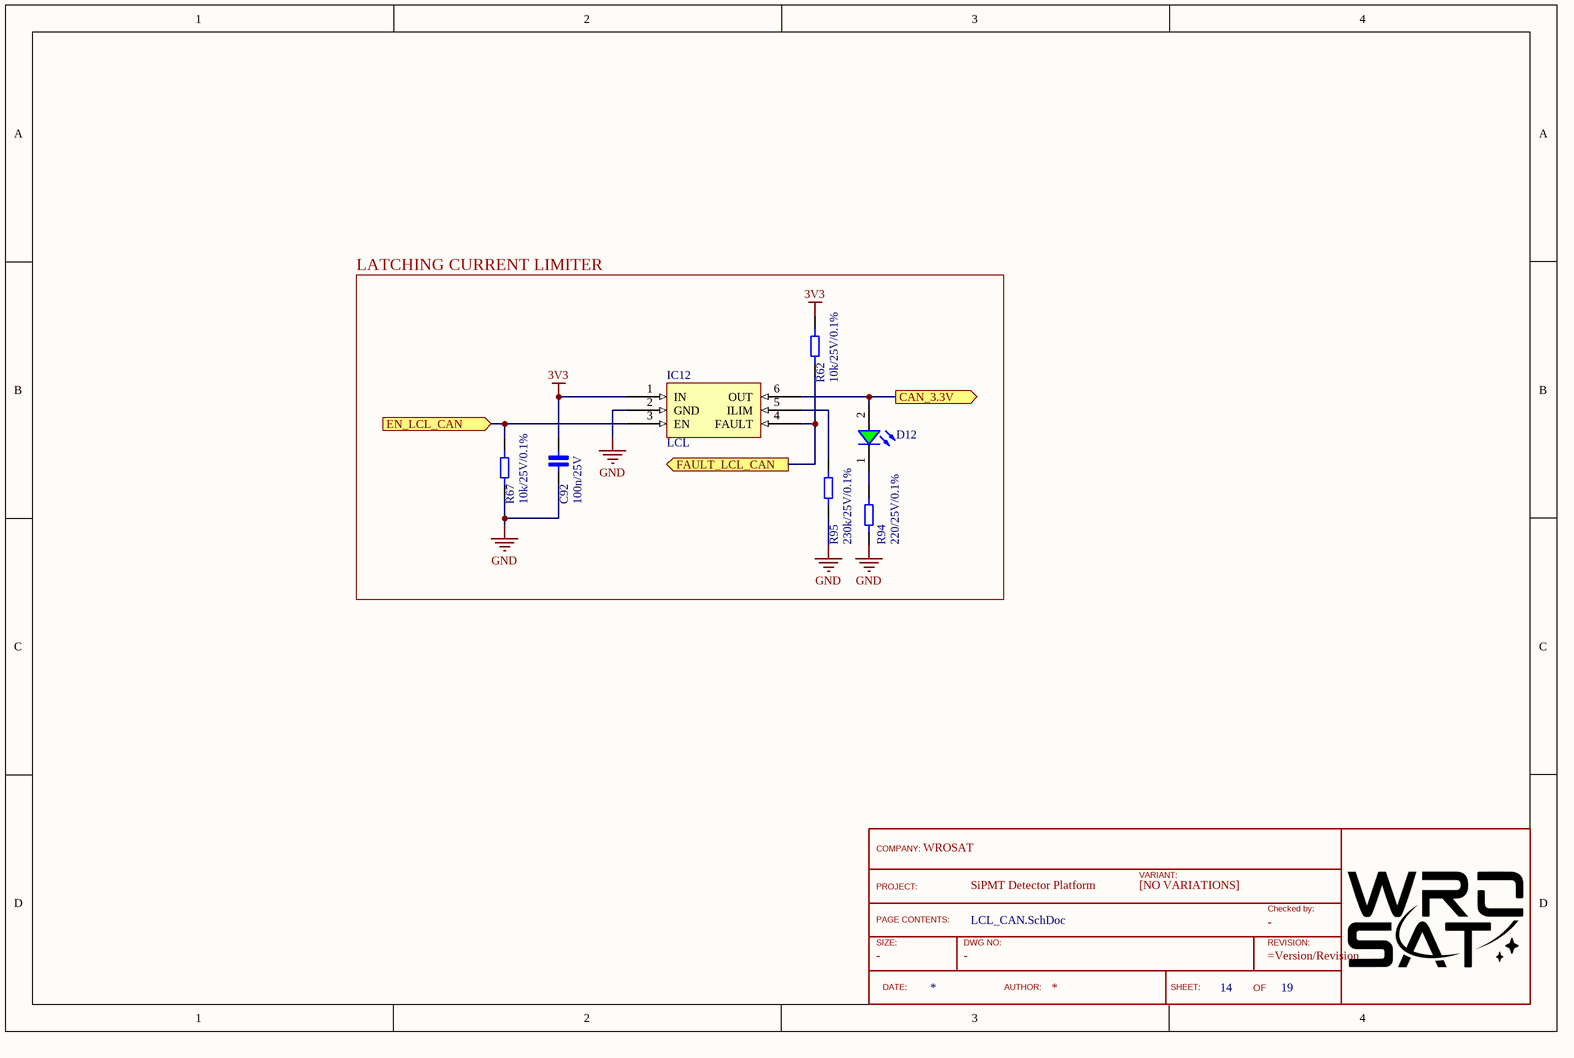
[diagram p16: LCL_CAN.SchDoc]

### Parts
(Parts that share a designator on the sheet are numbered #1, #2 ... from top to bottom, then left to right.)
?#15  TitleBlock  (value not drawn)  (graphical)
C92  100n/25V  [Cap_0402]
D12  Green, 3.2V  [WL-SMCW_0603_H=0.7mm]  (value not drawn)
IC12  LCL  [SOT-23-6]
R62  10k/25V/0.1%  [RES_0402]
R67  10k/25V/0.1%  [RES_0402]
R94  220/25V/0.1%  [RES_0402]
R95  230k/25V/0.1%  [RES_0402]

### Blocks framed on the sheet
LATCHING CURRENT LIMITER: C92 D12 IC12 R62 R67 R94 R95

### Ports
CAN_3.3V (out), EN_LCL_CAN (in), FAULT_LCL_CAN (out)

### Nets
3V3: C92.2 IC12.1(IN) R62.2
GND: C92.1 IC12.2(GND) R67.1 R94.1 R95.1
CAN_3.3V: D12.2(A) IC12.6(OUT) ; port CAN_3.3V
EN_LCL_CAN: IC12.3(EN) R67.2 ; port EN_LCL_CAN
FAULT_LCL_CAN: IC12.4(FAULT) R62.1 ; port FAULT_LCL_CAN
NetD12_1: D12.1(K) R94.2
NetIC12_5: IC12.5(ILIM) R95.2

### Notes on the sheet
- Title
- Size:
- Date:
- A3
- Number:
- Time:
- Revision:
- Sheet
- of
- File:
- (in symbol TitleBlock) COMPANY:; VARIANT:; PROJECT:; [NO VARIATIONS]; Checked by:; PAGE CONTENTS:; SIZE:; DWG NO:; REVISION:; DATE:; AUTHOR:; SHEET:; OF

### Library data of the parts
?#15 = TitleBlock: Standard TitleBlock; DrawingNo: -; Size: -; Checked: -
C92 = Cap_0402_100n: as C12 on sheet Dual_signal_switch; ComponentLink1Description: New link; ComponentLink1URL: https://www.we-online.com/catalog/en/WCAP-CSGP-25VDC
D12 = 150060GS75000: as D1 on sheet Dual_signal_switch; Viewing Angle: 140deg; ComponentLink1Description: Manufacturer; ComponentLink1URL: http://www.we-online.de; ComponentLink2URL: https://www.we-online.com/catalog/datasheet/150060GS75000.pdf; ComponentLink2Description: Datasheet; Forward Voltage typ.: 3.2V; Emitting Color: Green; Mounting Technology: SMT; Operating Temperature: -40 to +85degC; Published Date: December 2019; Part Number: 150060GS75000; Packaging: Tape and Reel; Size: 0603; Publisher: Wurth Elektronik
IC12 = TPS2553: Latch-off Current Limiter; ComponentLink1Description: New link; ComponentLink1URL: https://www.ti.com/lit/ds/symlink/tps2553.pdf?ts=1603819295065&ref_url=https%253A%252F%252Fwww.google.com%252F
R62 R67 = Res_0402_10k: Vishay, thin film resistor 10k/25V/0.1%
R94 = Res_0402_1: Vishay, thin film resistor 1/25V/0.1%
R95 = Res_0402_230k: Vishay, thin film resistor 230k/25V/0.1%

## Sheet Customer_Module-APS_Connector.SchDoc
size A4; DocumentNumber: 16; SheetNumber: 16; SheetTotal: 19
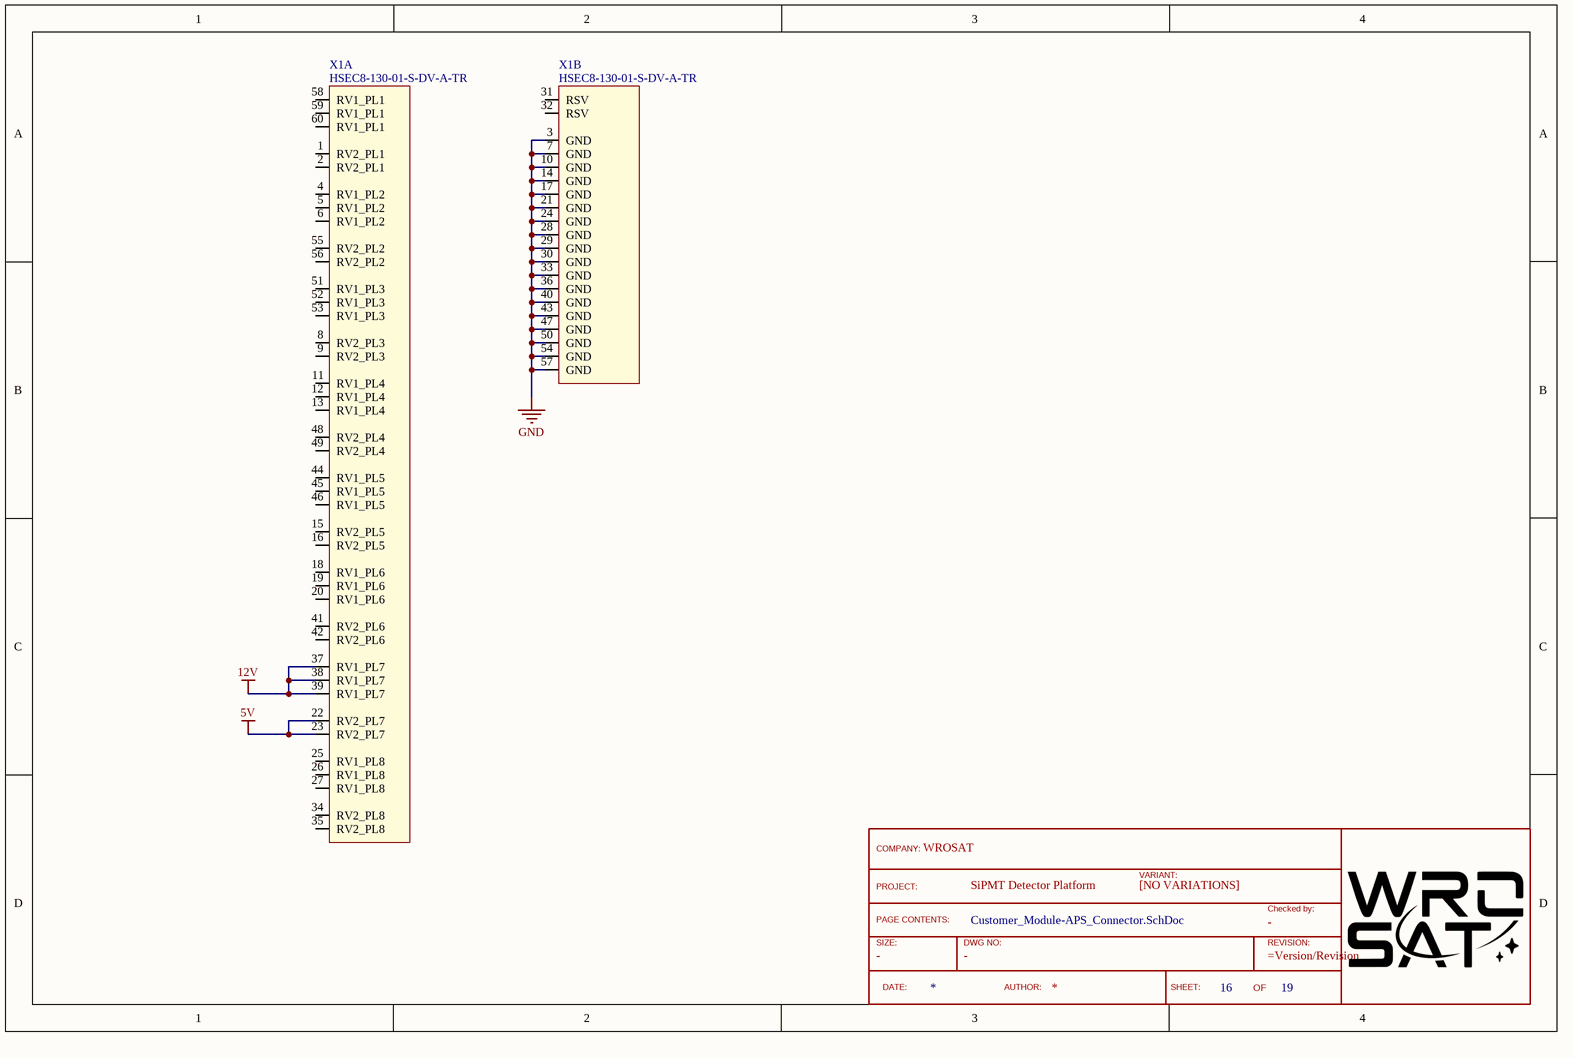
[diagram p17: Customer_Module-APS_Connector.SchDoc]

### Parts
(Parts that share a designator on the sheet are numbered #1, #2 ... from top to bottom, then left to right.)
?#16  TitleBlock  (value not drawn)  (graphical)
X1  HSEC8-130-01-S-DV-A-TR  [HSEC8-130-01-S-DV-A-TR]  (parts A,B of 2)

### Nets
5V: X1.22(RV2_PL7) X1.23(RV2_PL7)
12V: X1.37(RV1_PL7) X1.38(RV1_PL7) X1.39(RV1_PL7)
GND: X1.3(GND) X1.7(GND) X1.10(GND) X1.14(GND) X1.17(GND) X1.21(GND) X1.24(GND) X1.28(GND) X1.29(GND) X1.30(GND) X1.33(GND) X1.36(GND) X1.40(GND) X1.43(GND) X1.47(GND) X1.50(GND) X1.54(GND) X1.57(GND)

Not connected (* = marked no-connect by the designer): X1 1(RV2_PL1) 2(RV2_PL1) 4(RV1_PL2) 5(RV1_PL2) 6(RV1_PL2) 8(RV2_PL3) 9(RV2_PL3) 11(RV1_PL4) 12(RV1_PL4) 13(RV1_PL4) 15(RV2_PL5) 16(RV2_PL5) 18(RV1_PL6) 19(RV1_PL6) 20(RV1_PL6) 25(RV1_PL8) 26(RV1_PL8) 27(RV1_PL8) 31(RSV) 32(RSV) 34(RV2_PL8) 35(RV2_PL8) 41(RV2_PL6) 42(RV2_PL6) 44(RV1_PL5) 45(RV1_PL5) 46(RV1_PL5) 48(RV2_PL4) 49(RV2_PL4) 51(RV1_PL3) 52(RV1_PL3) 53(RV1_PL3) 55(RV2_PL2) 56(RV2_PL2) 58(RV1_PL1) 59(RV1_PL1) 60(RV1_PL1)

### Notes on the sheet
- (in symbol TitleBlock) COMPANY:; VARIANT:; PROJECT:; [NO VARIATIONS]; Checked by:; PAGE CONTENTS:; SIZE:; DWG NO:; REVISION:; DATE:; AUTHOR:; SHEET:; OF

### Library data of the parts
?#16 = TitleBlock: Standard TitleBlock; DrawingNo: -; Size: -; Checked: -

## Sheet Customer_Module-Main_Connector.SchDoc
size A4; DocumentNumber: 17; SheetNumber: 17; SheetTotal: 19
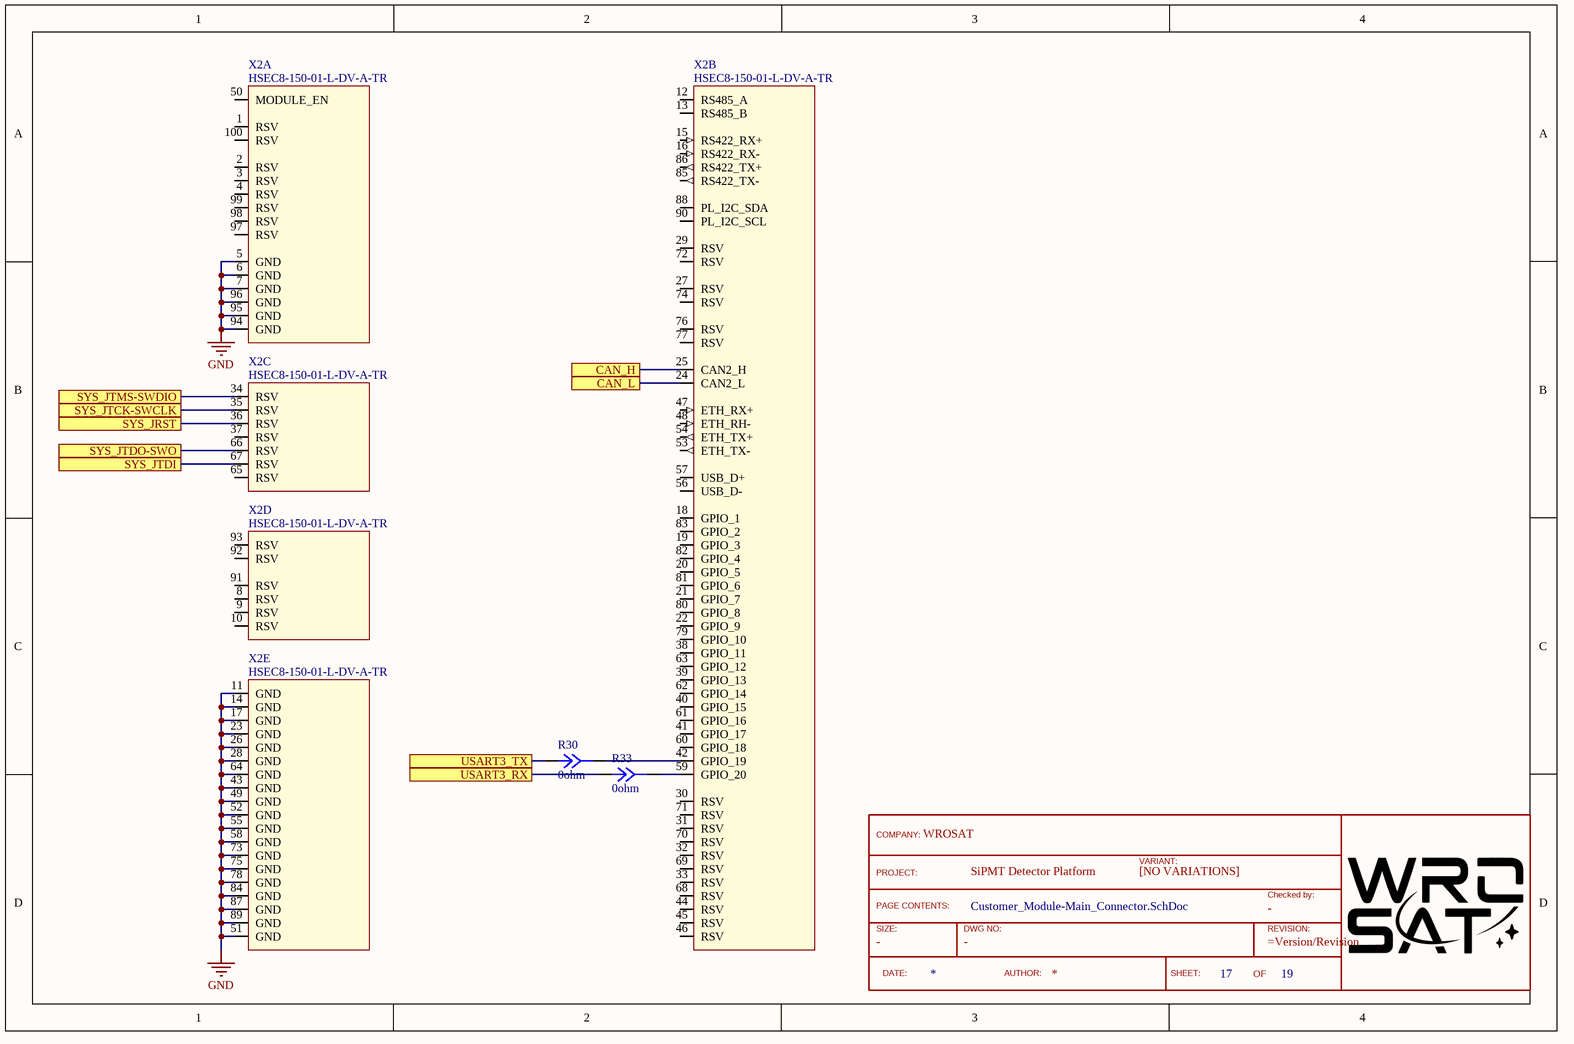
[diagram p18: Customer_Module-Main_Connector.SchDoc]

### Parts
(Parts that share a designator on the sheet are numbered #1, #2 ... from top to bottom, then left to right.)
?#17  TitleBlock  (value not drawn)  (graphical)
R30  0ohm  [Jumper 2]
R33  0ohm  [Jumper 2]
X2  HSEC8-150-01-L-DV-A-TR  [HSEC8-150-01-L-DV-A-TR]  (parts A,B,C,D,E of 5)

### Ports
CAN_H, CAN_L, SYS_JRST, SYS_JTCK-SWCLK, SYS_JTDI, SYS_JTDO-SWO, SYS_JTMS-SWDIO, USART3_RX, USART3_TX

### Nets
GND: X2.5(GND) X2.6(GND) X2.7(GND) X2.11(GND) X2.14(GND) X2.17(GND) X2.23(GND) X2.26(GND) X2.28(GND) X2.43(GND) X2.49(GND) X2.51(GND) X2.52(GND) X2.55(GND) X2.58(GND) X2.64(GND) X2.73(GND) X2.75(GND) X2.78(GND) X2.84(GND) X2.87(GND) X2.89(GND) X2.94(GND) X2.95(GND) X2.96(GND)
CAN_N: X2.24(CAN2_L) ; port CAN_L
CAN_P: X2.25(CAN2_H) ; port CAN_H
SYS_JRST: X2.36(RSV) ; port SYS_JRST
SYS_JTCK-SWCLK: X2.35(RSV) ; port SYS_JTCK-SWCLK
SYS_JTDI: X2.67(RSV) ; port SYS_JTDI
SYS_JTDO-SWO: X2.66(RSV) ; port SYS_JTDO-SWO
SYS_JTMS-SWDIO: X2.34(RSV) ; port SYS_JTMS-SWDIO
USART3_RX: R33.1 ; port USART3_RX
USART3_TX: R30.1 ; port USART3_TX
NetR30_2: R30.2 X2.42(GPIO_19)
NetR33_2: R33.2 X2.59(GPIO_20)

Not connected (* = marked no-connect by the designer): X2 1(RSV) 2(RSV) 3(RSV) 4(RSV) 8(RSV) 9(RSV) 10(RSV) 12(RS485_A) 13(RS485_B) 15(RS422_RX+) 16(RS422_RX-) 18(GPIO_1) 19(GPIO_3) 20(GPIO_5) 21(GPIO_7) 22(GPIO_9) 27(RSV) 29(RSV) 30(RSV) 31(RSV) 32(RSV) 33(RSV) 37(RSV) 38(GPIO_11) 39(GPIO_13) 40(GPIO_15) 41(GPIO_17) 44(RSV) 45(RSV) 46(RSV) 47(ETH_RX+) 48(ETH_RH-) 50(MODULE_EN) 53(ETH_TX-) 54(ETH_TX+) 56(USB_D-) 57(USB_D+) 60(GPIO_18) 61(GPIO_16) 62(GPIO_14) 63(GPIO_12) 65(RSV) 68(RSV) 69(RSV) 70(RSV) 71(RSV) 72(RSV) 74(RSV) 76(RSV) 77(RSV) 79(GPIO_10) 80(GPIO_8) 81(GPIO_6) 82(GPIO_4) 83(GPIO_2) 85(RS422_TX-) 86(RS422_TX+) 88(PL_I2C_SDA) 90(PL_I2C_SCL) 91(RSV) 92(RSV) 93(RSV) 97(RSV) 98(RSV) 99(RSV) 100(RSV)

### Notes on the sheet
- (in symbol TitleBlock) COMPANY:; VARIANT:; PROJECT:; [NO VARIATIONS]; Checked by:; PAGE CONTENTS:; SIZE:; DWG NO:; REVISION:; DATE:; AUTHOR:; SHEET:; OF

### Library data of the parts
?#17 = TitleBlock: Standard TitleBlock; DrawingNo: -; Size: -; Checked: -
R30 R33 = Mini jumper

## Sheet TempSensor.SchDoc
size A4; Organization: Altium Limited; Address1: L3, 12a Rodborough Rd; Address2: Frenchs Forest; Address3: NSW; Address4: Australia 2086; DocumentNumber: 7; SheetNumber: 7; SheetTotal: 12
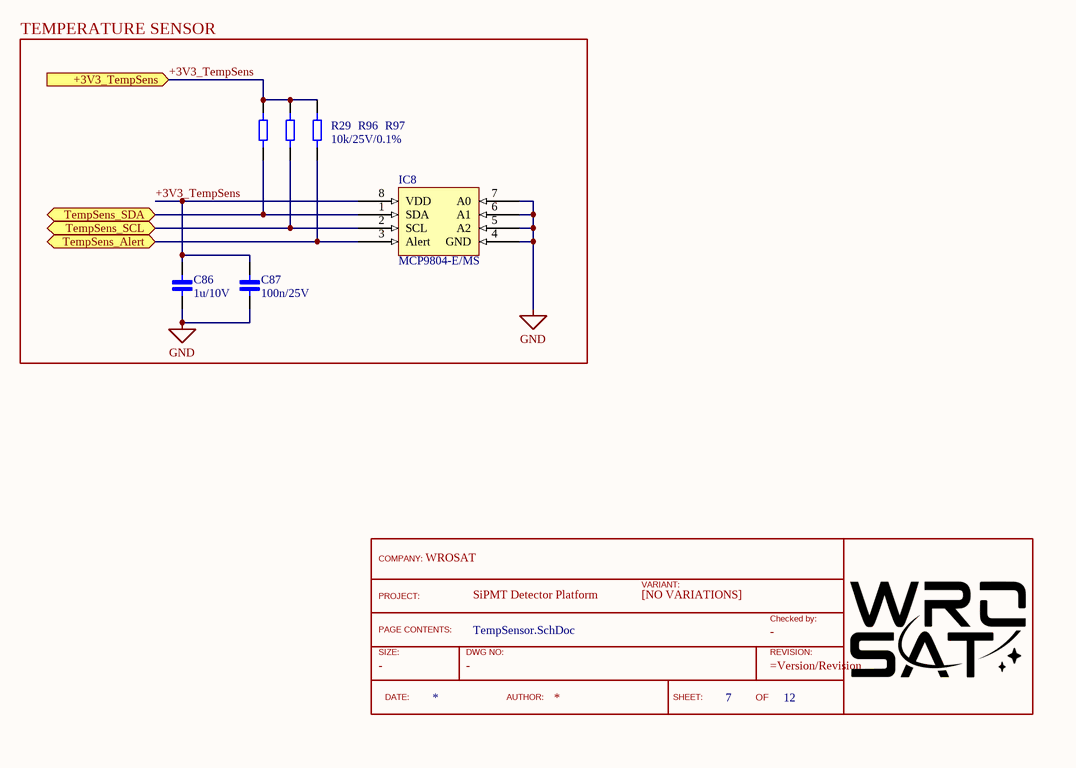
[diagram p19: TempSensor.SchDoc]

### Parts
(Parts that share a designator on the sheet are numbered #1, #2 ... from top to bottom, then left to right.)
?#18  TitleBlock  (value not drawn)  (graphical)
C86  1u/10V  [Cap_0402]
C87  100n/25V  [Cap_0402]
IC8  MCP9804-E/MS  [MSOP-8]
R29  10k/25V/0.1%  [RES_0402]
R96  10k/25V/0.1%  [RES_0402]  (value not drawn)
R97  10k/25V/0.1%  [RES_0402]  (value not drawn)

### Blocks framed on the sheet
TEMPERATURE SENSOR: C86 C87 IC8 R29 R96 R97

### Ports
+3V3_TempSens (in), TempSens_Alert (bidir), TempSens_SCL (bidir), TempSens_SDA (bidir)

### Nets
GND: C86.1 C87.1 IC8.4(GND) IC8.5(A2) IC8.6(A1) IC8.7(A0)
+3V3_TempSens: C86.2 C87.2 IC8.8(VDD) R29.2 R96.2 R97.2 ; port +3V3_TempSens
TempSens_Alert: IC8.3(Alert) R97.1 ; port TempSens_Alert
TempSens_SCL: IC8.2(SCL) R96.1 ; port TempSens_SCL
TempSens_SDA: IC8.1(SDA) R29.1 ; port TempSens_SDA

### Notes on the sheet
- Title
- Size:
- Date:
- A3
- Number:
- Time:
- Revision:
- Sheet
- of
- File:
- (in symbol TitleBlock) COMPANY:; VARIANT:; PROJECT:; [NO VARIATIONS]; Checked by:; PAGE CONTENTS:; SIZE:; DWG NO:; REVISION:; DATE:; AUTHOR:; SHEET:; OF

### Library data of the parts
?#18 = TitleBlock: Standard TitleBlock; DrawingNo: -; Size: -; Checked: -
C86 = Cap_0402_1u: Ceramic Capacitor 1uF / 0402 / 10V / ±5%, Wurth Elektronik MLCC
C87 = Cap_0402_100n: as C12 on sheet Dual_signal_switch; ComponentLink1Description: New link; ComponentLink1URL: https://www.we-online.com/catalog/en/WCAP-CSGP-25VDC
IC8 = MCP9804-E/MS: Temp Sensor Digital Serial (2-Wire) Automotive 8-Pin MSOP; Manufacturer: Microchip; Interface: I2C,SMBus,2-Wire,Serial; Max Supply Voltage: 5.5V; Min Supply Voltage: 2.7V; Resolution: 12b; Output Type: I2C,Digital; Operating Supply Current: 200uA; Accuracy: 1%; Sensor Type: Temperature; Output Current: 1uA; Number of Bits: 12; Supplier 1: Digi-Key; Manufacturer Part Number: MCP9804-E/MS; RoHS: Yes; Category: Temperature and Humidity Sensors; Stock 1: 933; Pricing 1: 1=1.68000, 25=1.40000, 100=1.27000 (USD); Mount: Surface Mount; Case/Package: MSOP; Number of Pins: 8; Contact Plating: Tin,Matte; Min Operating Temperature: -40°C; Max Operating Temperature: 125°C; Packaging: Rail/Tube; Package Quantity: 100; Max Supply Voltage (DC): 5.5V; Min Supply Voltage (DC): 2.7V; Termination: SMD/SMT; Max Output Current: 200uA; Length: 0.118inch; Width: 0.118inch; Height: 0.037inch; Radiation Hardening: No; Lead Free: Lead Free; REACH SVHC: No SVHC; ComponentLink1URL: https://datasheet.ciiva.com/16635/22203b-16635824.pdf?src-supplier=Avnet+Europe; ComponentLink1Description: https://datasheet.ciiva.com/16635/22203b-16635824.pdf?src-supplier=Avnet+Europe; ComponentLink2URL: https://datasheet.ciiva.com/2002/22203c-2002916.pdf?src-supplier=Digi-Key; ComponentLink2Description: https://datasheet.ciiva.com/2002/22203c-2002916.pdf?src-supplier=Digi-Key; ComponentLink3URL: https://datasheet.ciiva.com/16453/filehandler-aspxddocname-en544703-16453766.pdf?src-supplier=Future+Electronics; ComponentLink3Description: https://datasheet.ciiva.com/16453/filehandler-aspxddocname-en544703-16453766.pdf?src-supplier=Future+Electronics; ComponentLink4URL: https://datasheet.ciiva.com/3278/22203b-3278286.pdf?src-supplier=Avnet; ComponentLink4Description: https://datasheet.ciiva.com/3278/22203b-3278286.pdf?src-supplier=Avnet; ComponentLink5URL: https://datasheet.ciiva.com/26344/651539-da-01-en-ic-temp-sens-mcp9804-e-ms-msop-8-mcp-26344475.pdf?src-supplier=Conrad; ComponentLink5Description: https://datasheet.ciiva.com/26344/651539-da-01-en-ic-temp-sens-mcp9804-e-ms-msop-8-mcp-26344475.pdf?src-supplier=Conrad; Supplier Part Number 1: MCP9804-E/MS-ND
R29 R96 R97 = Res_0402_10k: Vishay, thin film resistor 10k/25V/0.1%

## Sheet LCL_TempSensor.SchDoc
size A4; Organization: Altium Limited; Address1: L3, 12a Rodborough Rd; Address2: Frenchs Forest; Address3: NSW; Address4: Australia 2086; DocumentNumber: 7; SheetNumber: 7; SheetTotal: 12
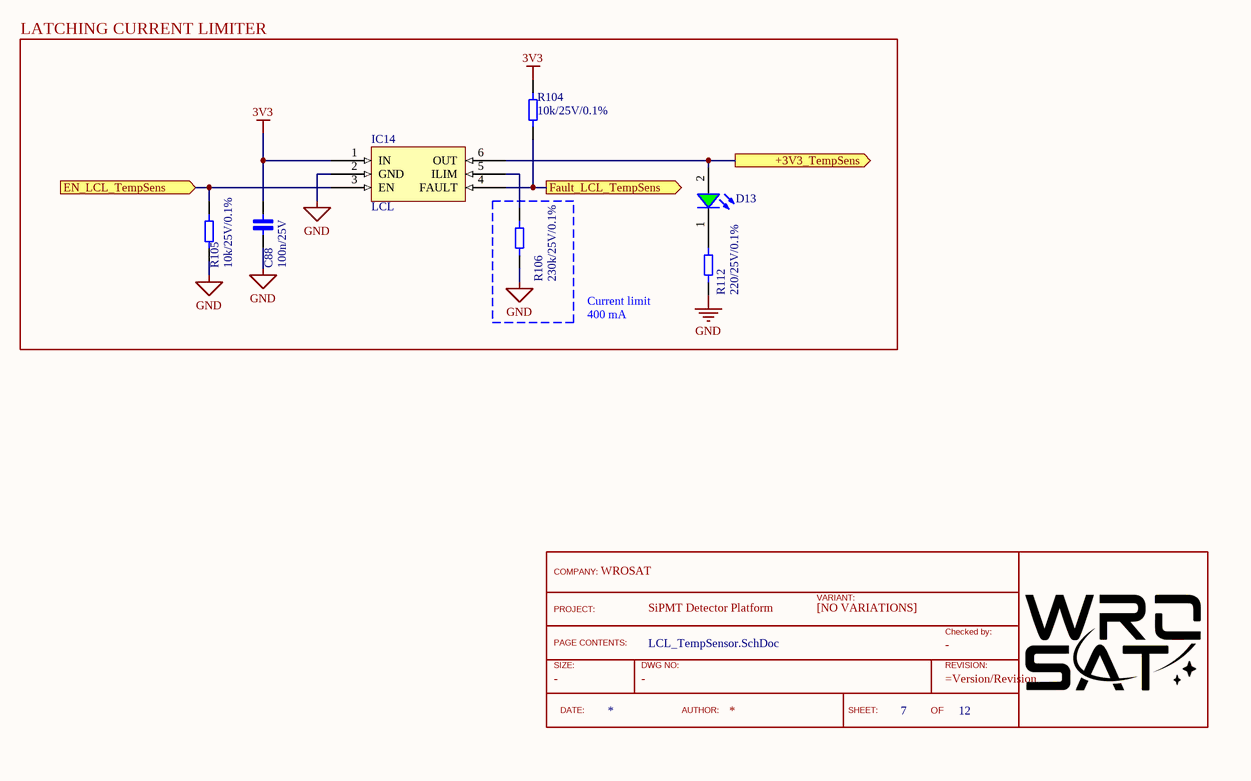
[diagram p20: LCL_TempSensor.SchDoc]

### Parts
(Parts that share a designator on the sheet are numbered #1, #2 ... from top to bottom, then left to right.)
?#19  TitleBlock  (value not drawn)  (graphical)
C88  100n/25V  [Cap_0402]
D13  Green, 3.2V  [WL-SMCW_0603_H=0.7mm]  (value not drawn)
IC14  LCL  [SOT-23-6]
R104  10k/25V/0.1%  [RES_0402]
R105  10k/25V/0.1%  [RES_0402]
R106  230k/25V/0.1%  [RES_0402]
R112  220/25V/0.1%  [RES_0402]

### Blocks framed on the sheet
LATCHING CURRENT LIMITER: C88 D13 IC14 R104-R106 R112

### Ports
+3V3_TempSens (out), EN_LCL_TempSens (in), Fault_LCL_TempSens (out)

### Nets
3V3: C88.2 IC14.1(IN) R104.2
GND: C88.1 IC14.2(GND) R105.1 R106.1 R112.1
+3V3_TempSens: D13.2(A) IC14.6(OUT) ; port +3V3_TempSens
EN_LCL_TempSens: IC14.3(EN) R105.2 ; port EN_LCL_TempSens
Fault_LCL_TempSens: IC14.4(FAULT) R104.1 ; port Fault_LCL_TempSens
NetD13_1: D13.1(K) R112.2
NetIC14_5: IC14.5(ILIM) R106.2

### Notes on the sheet
- (near R112) Current limit
- 400 mA
- Title
- Size:
- Date:
- A3
- Number:
- Time:
- Revision:
- Sheet
- of
- File:
- (in symbol TitleBlock) COMPANY:; VARIANT:; PROJECT:; [NO VARIATIONS]; Checked by:; PAGE CONTENTS:; SIZE:; DWG NO:; REVISION:; DATE:; AUTHOR:; SHEET:; OF

### Library data of the parts
?#19 = TitleBlock: Standard TitleBlock; DrawingNo: -; Size: -; Checked: -
C88 = Cap_0402_100n: as C12 on sheet Dual_signal_switch; ComponentLink1Description: New link; ComponentLink1URL: https://www.we-online.com/catalog/en/WCAP-CSGP-25VDC
D13 = 150060GS75000: as D1 on sheet Dual_signal_switch; Viewing Angle: 140deg; ComponentLink1Description: Manufacturer; ComponentLink1URL: http://www.we-online.de; ComponentLink2URL: https://www.we-online.com/catalog/datasheet/150060GS75000.pdf; ComponentLink2Description: Datasheet; Forward Voltage typ.: 3.2V; Emitting Color: Green; Mounting Technology: SMT; Operating Temperature: -40 to +85degC; Published Date: December 2019; Part Number: 150060GS75000; Packaging: Tape and Reel; Size: 0603; Publisher: Wurth Elektronik
IC14 = TPS2553: Latch-off Current Limiter; ComponentLink1Description: New link; ComponentLink1URL: https://www.ti.com/lit/ds/symlink/tps2553.pdf?ts=1603819295065&ref_url=https%253A%252F%252Fwww.google.com%252F
R104 R105 = Res_0402_10k: Vishay, thin film resistor 10k/25V/0.1%
R106 = Res_0402_230k: Vishay, thin film resistor 230k/25V/0.1%
R112 = Res_0402_1: Vishay, thin film resistor 1/25V/0.1%

## Nets that join several sheets
3V3: General_design (C32.1), MCU (9 pins), MRAM (FB32.1), MCU_LDO (5 pins), LCL_CAN (C92.2 IC12.1 R62.2), LCL_TempSensor (C88.2 IC14.1 R104.2)
5V: General_design (D3.2 P1.3), prec_3V_LDO (FB26.1), MCU_LDO (FB27.1), Customer_Module-APS_Connector (X1.22 X1.23)
12V: General_design (D4.2 P1.4), LCL_12V_prec (FB29.1), LCL_12V_chp (FB30.1), Customer_Module-APS_Connector (X1.37 X1.38 X1.39)
+5: General_design (C32.2), Preamplifier1 (FB2_Preamplifier1.2 FB4_Preamplifier1.1 FB6_Preamplifier1.1), Preamplifier2 (FB2_Preamplifier2.2 FB4_Preamplifier2.1 FB6_Preamplifier2.1), Comparator (FB20.2 FB21.2 FB22.2), Symmetric_PS (C58.2 D17.2 IC6.12 R51.2), Dual_signal_switch (FB33.2 R107.2)
-5: Preamplifier1 (FB3_Preamplifier1.1), Preamplifier2 (FB3_Preamplifier2.1), Comparator (FB23.1 FB24.1 FB34.1 FB35.1), Symmetric_PS (C63.1 D18.1 IC6.5 R55.1)
GND: General_design (5 pins), SiPMT1 (C1_SiPMT1.1 C57_SiPMT1.1 R86_SiPMT1.1), SiPMT2 (C1_SiPMT2.1 C57_SiPMT2.1 R86_SiPMT2.1), Preamplifier1 (18 pins), Preamplifier2 (18 pins), PIN_bias_voltage (16 pins), MCU (35 pins), Comparator (22 pins), Symmetric_PS (13 pins), prec_3V_LDO (10 pins), CAN_transceiver (5 pins), MRAM (C93.1 C94.1 IC13.4 IC13.9), LCL_pin_bias (5 pins), prec_5V_LDO (10 pins), LCL_12V_prec (9 pins), LCL_12V_chp (9 pins), Dual_signal_switch (6 pins), MCU_LDO (10 pins), LCL_CAN (5 pins), Customer_Module-APS_Connector (18 pins), Customer_Module-Main_Connector (25 pins), TempSensor (6 pins), LCL_TempSensor (5 pins)
p5V: Preamplifier1 (FB1_Preamplifier1.2 FB5_Preamplifier1.1), Preamplifier2 (FB1_Preamplifier2.2 FB5_Preamplifier2.1), prec_5V_LDO (5 pins)
+3V3_TempSens: TempSensor (6 pins), LCL_TempSensor (D13.2 IC14.6)
ADC: MCU (R113.1), Comparator (R116.2)
Bias_3.3V: PIN_bias_voltage (FB7.1 FB8.1), LCL_pin_bias (D8.2 IC7.6)
Bias_voltage: SiPMT1 (R21_SiPMT1.1), SiPMT2 (R21_SiPMT2.1), PIN_bias_voltage (R109.2)
CAN_3.3V: CAN_transceiver (FB31.1), LCL_CAN (D12.2 IC12.6)
CAN_N: CAN_transceiver (D10.1 IC11.6 R77.1), Customer_Module-Main_Connector (X2.24)
CAN_P: CAN_transceiver (D10.2 IC11.7 R75.2), Customer_Module-Main_Connector (X2.25)
CAN_Serial_RX: MCU (IC4.70), CAN_transceiver (R70.1)
CAN_Serial_TX: MCU (IC4.71), CAN_transceiver (R68.1)
CAN_SHDN: MCU (IC4.67), CAN_transceiver (IC11.5)
CAN_Silent_mode: MCU (IC4.66), CAN_transceiver (IC11.8)
Chp_5V: Symmetric_PS (FB25.1), LCL_12V_chp (C85.2 D11.2 IC10.8)
CHP_EN: MCU (IC4.38), Symmetric_PS (IC6.1 IC6.13)
Comp_out: MCU (IC4.17), Comparator (R117.2 R118.2)
DAC_Vreg: PIN_bias_voltage (R23.1 TP11.1), MCU (IC4.29)
EN_bias: PIN_bias_voltage (IC3.13), MCU (IC4.52)
EN_LCL_bias: MCU (IC4.53), LCL_pin_bias (IC7.3 R81.2)
EN_LCL_CAN: MCU (IC4.62), LCL_CAN (IC12.3 R67.2)
EN_LCL_chp: MCU (IC4.39), LCL_12V_chp (R80.2)
EN_LCL_prec: MCU (IC4.58), LCL_12V_prec (R73.1)
EN_LCL_TempSens: MCU (IC4.45), LCL_TempSensor (IC14.3 R105.2)
FAULT_LCL_bias: MCU (IC4.54), LCL_pin_bias (IC7.4 R56.1)
FAULT_LCL_CAN: MCU (IC4.61), LCL_CAN (IC12.4 R62.1)
FAULT_LCL_chp: MCU (IC4.40), LCL_12V_chp (IC10.7 R76.1 R79.2)
FAULT_LCL_prec: MCU (IC4.59), LCL_12V_prec (IC9.7 R69.1 R72.2)
Fault_LCL_TempSens: MCU (IC4.44), LCL_TempSensor (IC14.4 R104.1)
MRAM_CS: MCU (IC4.63), MRAM (R98.1)
MRAM_HOLD: MCU (IC4.65), MRAM (R99.2)
MRAM_SCK: MCU (IC4.78), MRAM (R101.2)
MRAM_SI: MCU (IC4.80), MRAM (R103.2)
MRAM_SO: MCU (IC4.79), MRAM (R100.1)
MRAM_WP: MCU (IC4.64), MRAM (R102.1)
p3V_SHDN: MCU (IC4.57), prec_3V_LDO (U7.1)
P5V_SHDN: MCU (IC4.60), prec_5V_LDO (U9.1)
Prec_3.3V: prec_3V_LDO (5 pins), LCL_pin_bias (C65.2 IC7.1 R56.2)
Prec_5V: prec_5V_LDO (FB28.1), LCL_12V_prec (C83.2 D9.2 IC9.8)
Pulse_in: Comparator (R1.1 R2.1 R58.2), Dual_signal_switch (IC16.2)
SiPMT_out: SiPMT1 (R84_SiPMT1.1 R85_SiPMT1.1), Preamplifier1 (R6_Preamplifier1.1 U1_Preamplifier1.4)
SiPMT_out: SiPMT2 (R84_SiPMT2.1 R85_SiPMT2.1), Preamplifier2 (R6_Preamplifier2.1 U1_Preamplifier2.4)
SYS_JRST: MCU (IC4.90 P2.6), Customer_Module-Main_Connector (X2.36)
SYS_JTCK-SWCLK: MCU (IC4.76 P2.4), Customer_Module-Main_Connector (X2.35)
SYS_JTDI: MCU (IC4.77 P2.1), Customer_Module-Main_Connector (X2.67)
SYS_JTDO-SWO: MCU (IC4.89 P2.2), Customer_Module-Main_Connector (X2.66)
SYS_JTMS-SWDIO: MCU (IC4.72 P2.3), Customer_Module-Main_Connector (X2.34)
TempSens_Alert: MCU (IC4.46), TempSensor (IC8.3 R97.1)
TempSens_SCL: MCU (IC4.47), TempSensor (IC8.2 R96.1)
TempSens_SDA: MCU (IC4.48), TempSensor (IC8.1 R29.1)
Test_pulse_out: Preamplifier1 (R59_Preamplifier1.2), Preamplifier2 (R59_Preamplifier2.2), Comparator (R58.1)
USART3_RX: MCU (IC4.56), Customer_Module-Main_Connector (R33.1)
USART3_TX: MCU (IC4.55), Customer_Module-Main_Connector (R30.1)